# EAGLE design mainboard_eurobotics2010_r2 (EAGLE 4.16)

## Sheet 1 of 10
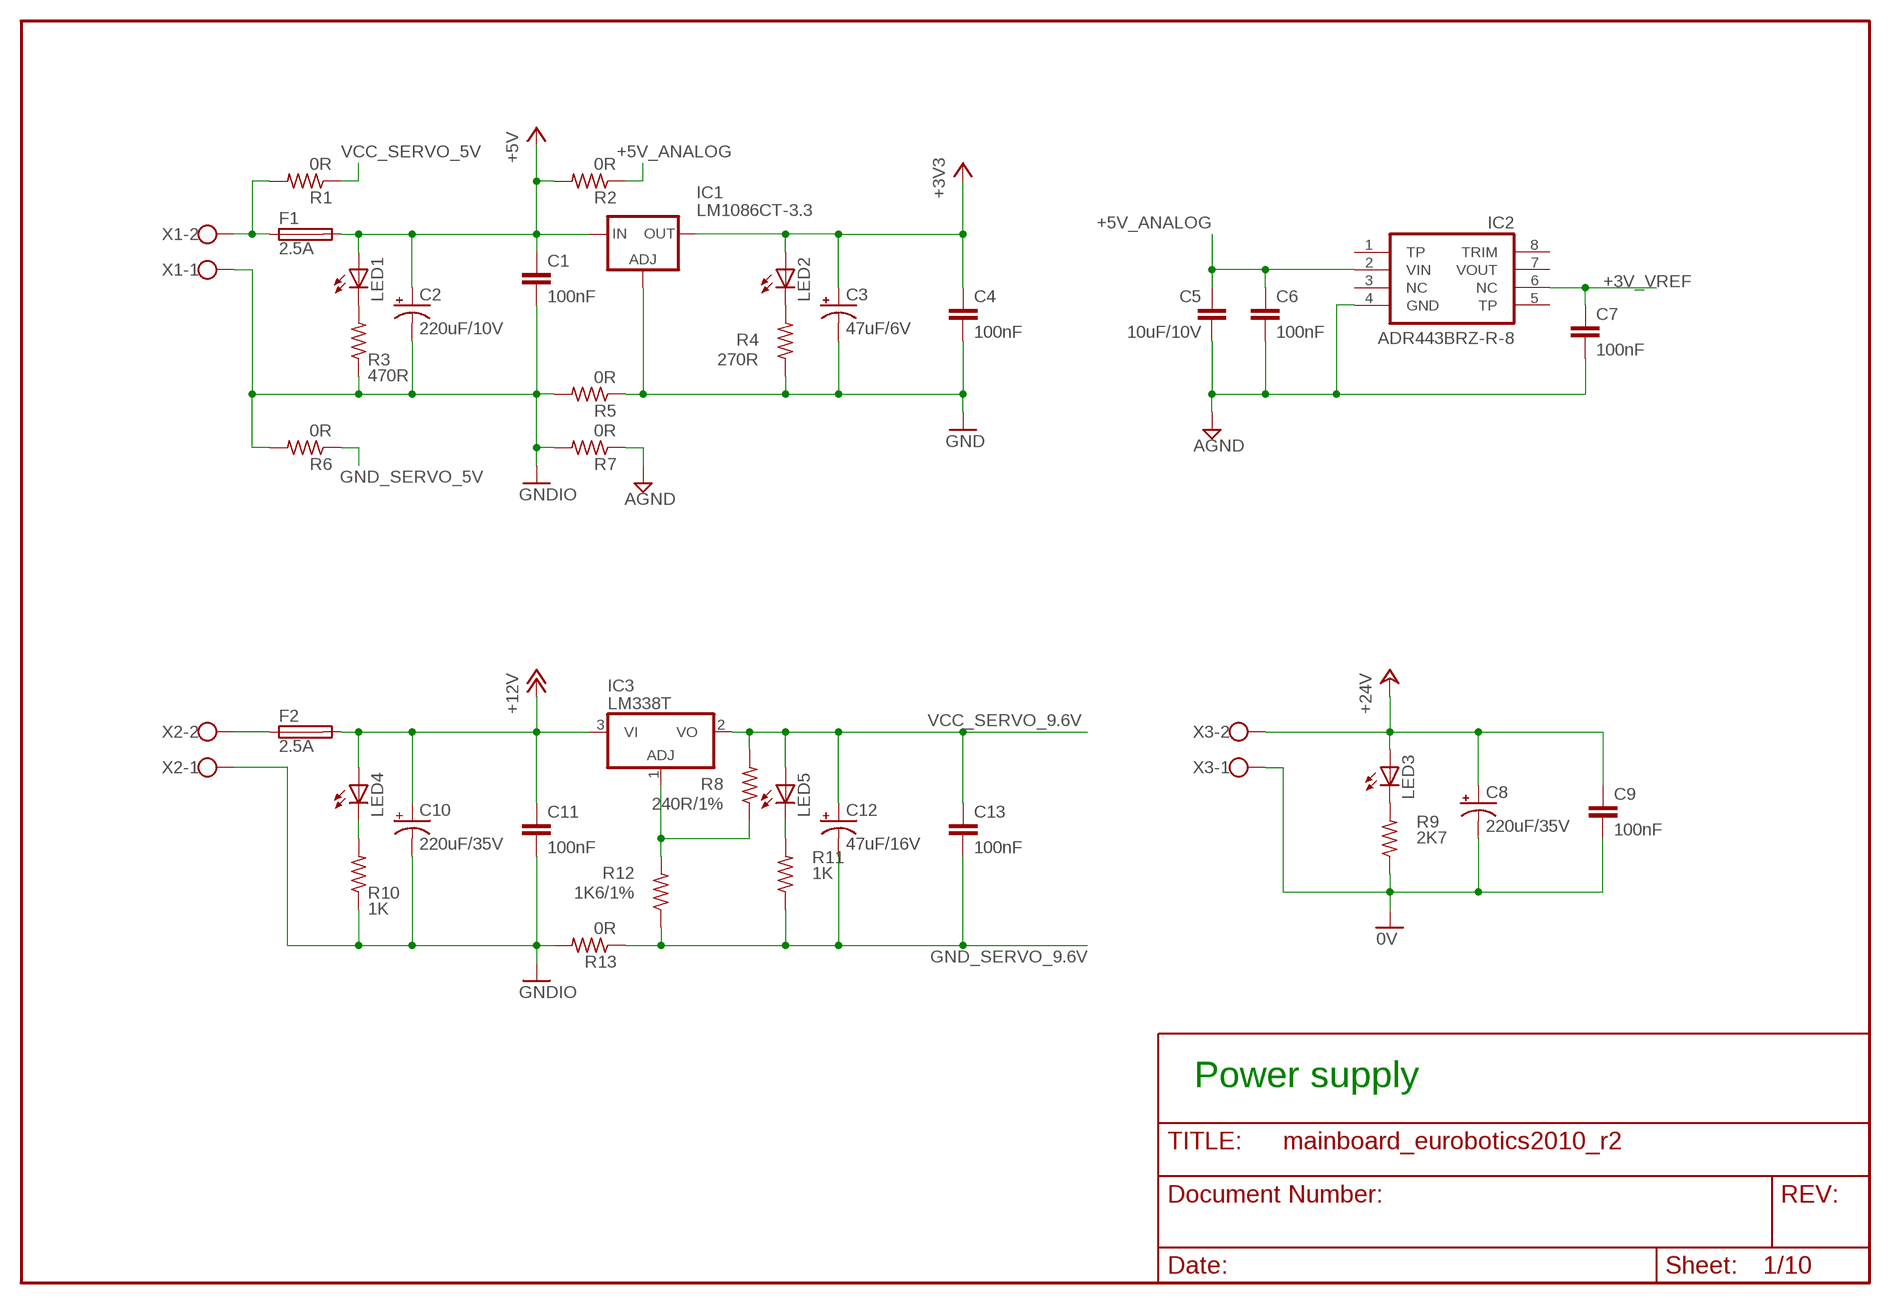
[diagram p0: schematic, sheet 1]

### Parts
C1  100nF  C-EUC0805  [C0805]
C2  220uF/10V  CPOL-USE2.5-7  [E2,5-7]
C3  47uF/6V  CPOL-USSMCD  [SMC_D]
C4  100nF  C-EUC0805  [C0805]
C5  10uF/10V  C-EUC1206  [C1206]
C6  100nF  C-EUC0805  [C0805]
C7  100nF  C-EUC0805  [C0805]
C8  220uF/35V  CPOL-USE5-10.5  [E5-10,5]
C9  100nF  C-EUC0805  [C0805]
C10  220uF/35V  CPOL-USE5-10.5  [E5-10,5]
C11  100nF  C-EUC0805  [C0805]
C12  47uF/16V  CPOL-USSMCD  [SMC_D]
C13  100nF  C-EUC0805  [C0805]
F1  2.5A  FUSEPICOFUSE  [PICOFUSE]
F2  2.5A  FUSEPICOFUSE  [PICOFUSE]
IC1  LM1086CT-3.3  LM317MABT  [TO220L1]
IC2  ADR443BRZ-R-8  ADR443  [SOIC8]
IC3  LM338T  317T  [TO220H]
LED1  LEDCHIP-LED0805  [CHIP-LED0805]
LED2  LEDCHIP-LED0805  [CHIP-LED0805]
LED3  LEDCHIP-LED0805  [CHIP-LED0805]
LED4  LEDCHIP-LED0805  [CHIP-LED0805]
LED5  LEDCHIP-LED0805  [CHIP-LED0805]
R1  0R  R-US_R0805  [R0805]
R2  0R  R-US_R0805  [R0805]
R3  470R  R-US_R0805  [R0805]
R4  270R  R-US_R0805  [R0805]
R5  0R  R-US_R0805  [R0805]
R6  0R  R-US_R0805  [R0805]
R7  0R  R-US_R0805  [R0805]
R8  240R/1%  R-US_R0805  [R0805]
R9  2K7  R-US_R0805  [R0805]
R10  1K  R-US_R0805  [R0805]
R11  1K  R-US_R0805  [R0805]
R12  1K6/1%  R-US_R0805  [R0805]
R13  0R  R-US_R0805  [R0805]
X1  W237-02P  [W237-132]
X2  W237-02P  [W237-132]
X3  W237-02P  [W237-132]

### Nets
0V: C8.- C9.2 R9.1 X3.1 ; also sheet 7,8
+3V3: C3.+ C4.1 IC1.2(OUT) LED2.A ; also sheet 2,3,9
+3V_VREF: C7.1 IC2.6(NC) ; also sheet 2,3,4,8
+5V: C1.1 C2.+ F1.2 IC1.3(IN) LED1.A R2.2 ; also sheet 2,5,6,7,8
+5V_ANALOG: C5.1 C6.1 IC2.2(VIN) R2.1 ; also sheet 4,8
+12V: C10.+ C11.1 F2.2 IC3.3(VI) LED4.A ; also sheet 4,5
+24V: C8.+ C9.1 LED3.A X3.2 ; also sheet 7,8
AGND: C5.2 C6.2 C7.2 IC2.4(GND) R7.1 ; also sheet 2,3,4,8
GND: C3.- C4.2 IC1.1(ADJ) R4.1 R5.1 ; also sheet 2,3,5,7,8,9
GND_SERVO_5V: R6.1 ; also sheet 6
GND_SERVO_9.6V: C12.- C13.2 R11.1 R12.1 R13.1 ; also sheet 6
GNDIO: C1.2 C2.- C10.- C11.2 R3.1 R5.2 R6.2 R7.2 R10.1 R13.2 X1.1 X2.1 ; also sheet 4,5
N$3: IC3.1(ADJ) R8.1 R12.2
N$12: LED5.C R11.2
N$64: LED1.C R3.2
N$65: LED2.C R4.2
N$66: LED4.C R10.2
N$67: LED3.C R9.2
N$112: F1.1 R1.2 X1.2
N$113: F2.1 X2.2
VCC_SERVO_5V: R1.1 ; also sheet 6
VCC_SERVO_9.6V: C12.+ C13.1 IC3.2(VO) LED5.A R8.2 ; also sheet 6
Unconnected: IC2.1(TP) IC2.3(NC) IC2.5(TP) IC2.7(VOUT) IC2.8(TRIM)

### Notes on the sheet
- Power supply

## Sheet 2 of 10
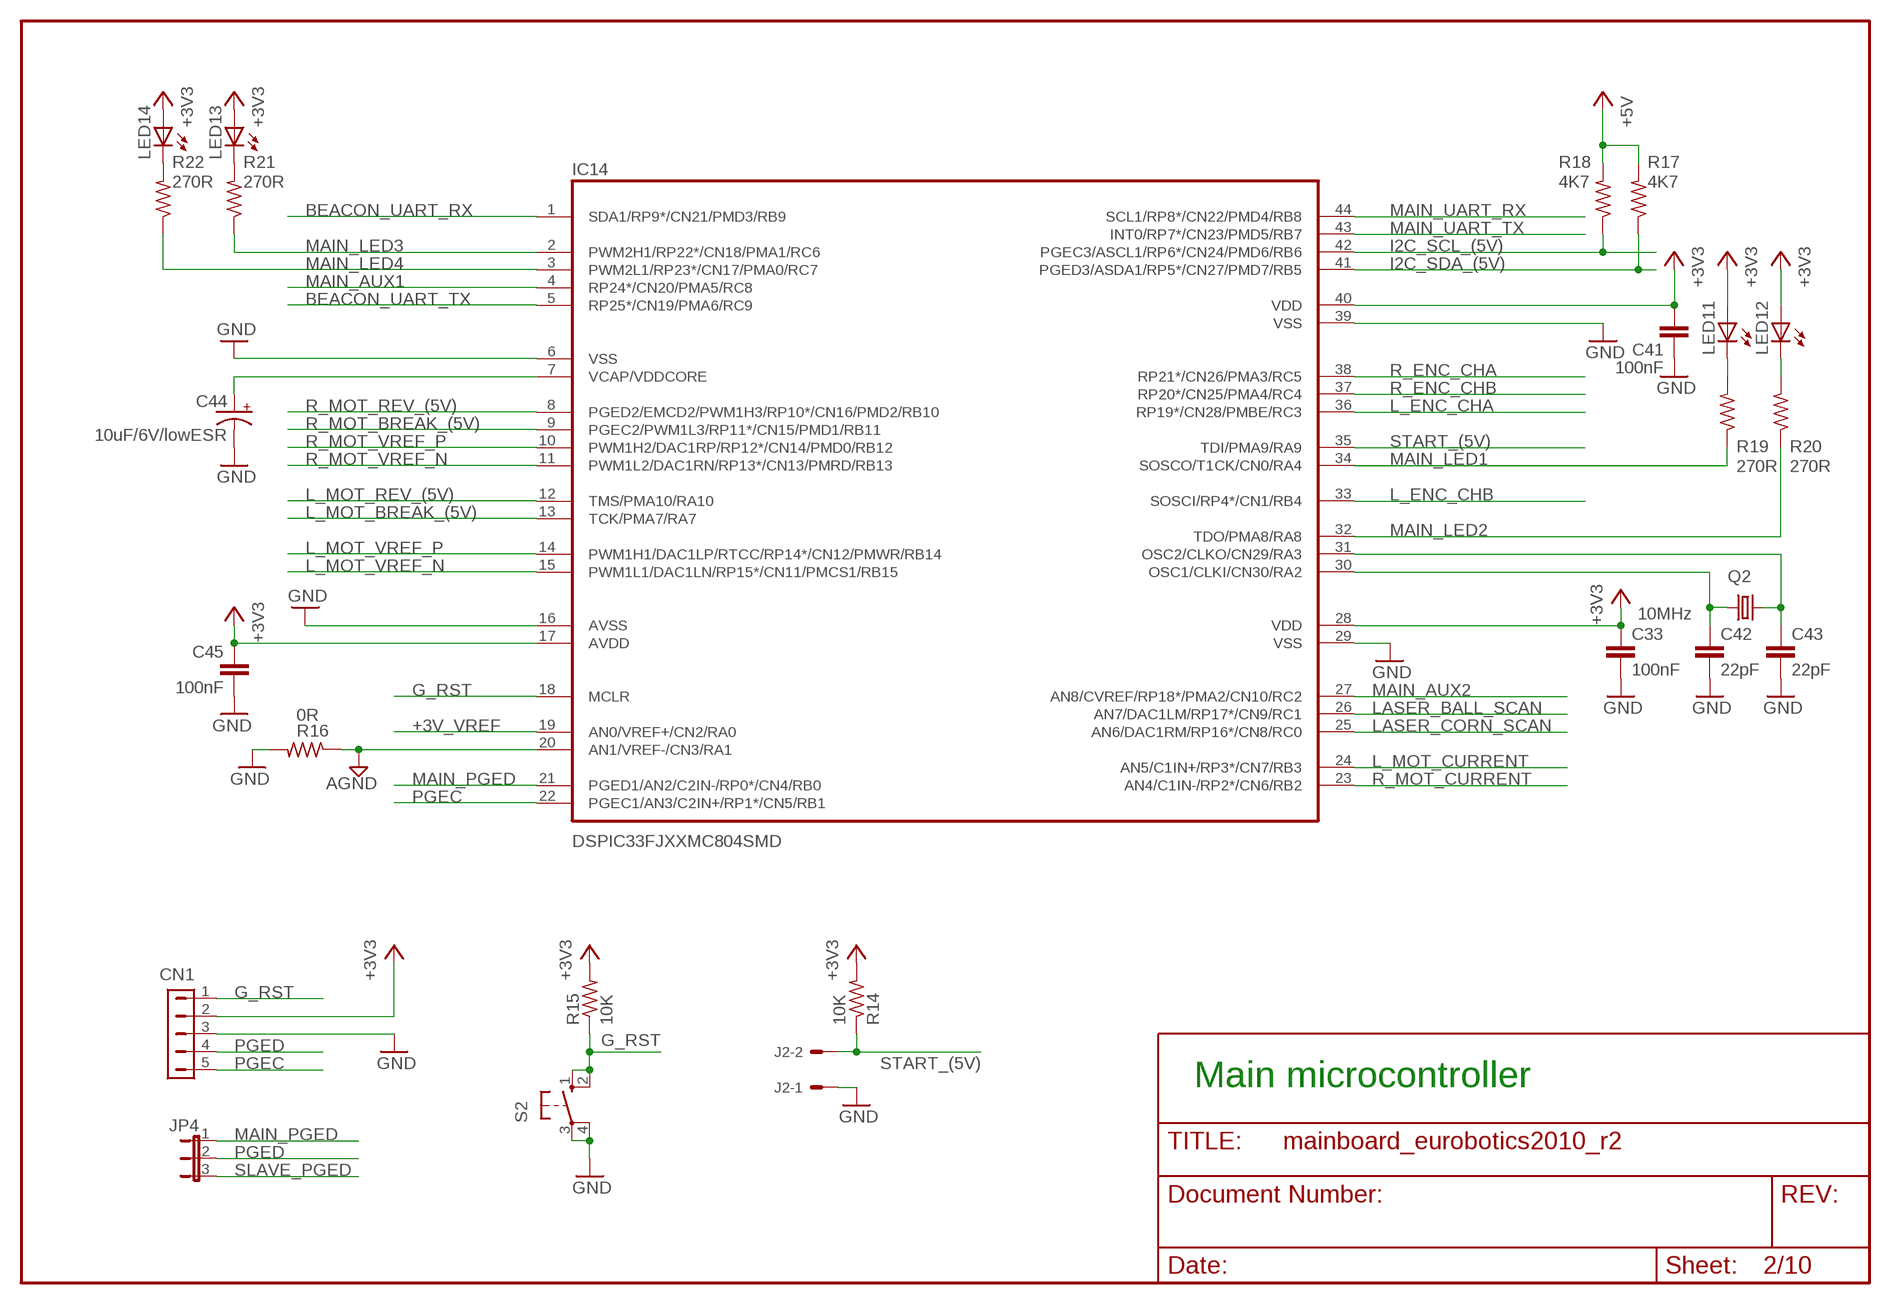
[diagram p1: schematic, sheet 2]

### Parts
C33  100nF  C-EUC0805  [C0805]
C41  100nF  C-EUC0805  [C0805]
C42  22pF  C-EUC0805  [C0805]
C43  22pF  C-EUC0805  [C0805]
C44  10uF/6V/lowESR  CPOL-USSMCA  [SMC_A]
C45  100nF  C-EUC0805  [C0805]
CN1  HDR-1X5-SIP-100  [SIP-100-5V]
IC14  DSPIC33FJXXMC804SMD  [TQFP44]
J2  22-27-2021-02  [6410-02]
JP4  JP2E  [JP2]
LED11  LEDCHIP-LED0805  [CHIP-LED0805]
LED12  LEDCHIP-LED0805  [CHIP-LED0805]
LED13  LEDCHIP-LED0805  [CHIP-LED0805]
LED14  LEDCHIP-LED0805  [CHIP-LED0805]
Q2  10MHz  CRYSTALHC49UP  [HC49UP]
R14  10K  R-US_R0805  [R0805]
R15  10K  R-US_R0805  [R0805]
R16  0R  R-US_R0805  [R0805]
R17  4K7  R-US_R0805  [R0805]
R18  4K7  R-US_R0805  [R0805]
R19  270R  R-US_R0805  [R0805]
R20  270R  R-US_R0805  [R0805]
R21  270R  R-US_R0805  [R0805]
R22  270R  R-US_R0805  [R0805]
S2  10-XX  [B3F-10XX]

### Nets
+3V3: C33.1 C41.1 C45.1 CN1.2 IC14.17(AVDD) IC14.28(VDD) IC14.40(VDD) LED11.A LED12.A LED13.A LED14.A R14.2 R15.2 ; also sheet 1,3,9
+3V_VREF: IC14.19(AN0/VREF+/CN2/RA0) ; also sheet 1,3,4,8
+5V: R17.2 R18.2 ; also sheet 1,5,6,7,8
AGND: IC14.20(AN1/VREF-/CN3/RA1) R16.1 ; also sheet 1,3,4,8
BEACON_UART_RX: IC14.1(SDA1/RP9*/CN21/PMD3/RB9) ; also sheet 9
BEACON_UART_TX: IC14.5(RP25*/CN19/PMA6/RC9) ; also sheet 9
G_RST: CN1.1 IC14.18(MCLR) R15.1 S2.1(S) S2.2(S1) ; also sheet 3
GND: C33.2 C41.2 C42.2 C43.2 C44.- C45.2 CN1.3 IC14.6(VSS) IC14.16(AVSS) IC14.29(VSS) IC14.39(VSS) J2.1 R16.2 S2.3(P) S2.4(P1) ; also sheet 1,3,5,7,8,9
I2C_SCL_(5V): IC14.42(PGEC3/ASCL1/RP6*/CN24/PMD6/RB6) R18.1 ; also sheet 3,5
I2C_SDA_(5V): IC14.41(PGED3/ASDA1/RP5*/CN27/PMD7/RB5) R17.1 ; also sheet 3,5
L_ENC_CHA: IC14.36(RP19*/CN28/PMBE/RC3) ; also sheet 5
L_ENC_CHB: IC14.33(SOSCI/RP4*/CN1/RB4) ; also sheet 5
L_MOT_BREAK_(5V): IC14.13(TCK/PMA7/RA7) ; also sheet 8
L_MOT_CURRENT: IC14.24(AN5/C1IN+/RP3*/CN7/RB3) ; also sheet 8
L_MOT_REV_(5V): IC14.12(TMS/PMA10/RA10) ; also sheet 8
L_MOT_VREF_N: IC14.15(PWM1L1/DAC1LN/RP15*/CN11/PMCS1/RB15) ; also sheet 8
L_MOT_VREF_P: IC14.14(PWM1H1/DAC1LP/RTCC/RP14*/CN12/PMWR/RB14) ; also sheet 8
LASER_BALL_SCAN: IC14.26(AN7/DAC1LM/RP17*/CN9/RC1) ; also sheet 4
LASER_CORN_SCAN: IC14.25(AN6/DAC1RM/RP16*/CN8/RC0) ; also sheet 4
MAIN_AUX1: IC14.4(RP24*/CN20/PMA5/RC8) ; also sheet 5
MAIN_AUX2: IC14.27(AN8/CVREF/RP18*/PMA2/CN10/RC2) ; also sheet 5
MAIN_LED1: IC14.34(SOSCO/T1CK/CN0/RA4) R19.1
MAIN_LED2: IC14.32(TDO/PMA8/RA8) R20.1
MAIN_LED3: IC14.2(PWM2H1/RP22*/CN18/PMA1/RC6) R21.1
MAIN_LED4: IC14.3(PWM2L1/RP23*/CN17/PMA0/RC7) R22.1
MAIN_PGED: IC14.21(PGED1/AN2/C2IN-/RP0*/CN4/RB0) JP4.1
MAIN_UART_RX: IC14.44(SCL1/RP8*/CN22/PMD4/RB8) ; also sheet 9
MAIN_UART_TX: IC14.43(INT0/RP7*/CN23/PMD5/RB7) ; also sheet 9
N$8: LED11.C R19.2
N$10: LED12.C R20.2
N$11: LED13.C R21.2
N$13: LED14.C R22.2
N$47: C43.1 IC14.31(OSC2/CLKO/CN29/RA3) Q2.2
N$48: C42.1 IC14.30(OSC1/CLKI/CN30/RA2) Q2.1
N$49: C44.+ IC14.7(VCAP/VDDCORE)
PGEC: CN1.5 IC14.22(PGEC1/AN3/C2IN+/RP1*/CN5/RB1) ; also sheet 3
PGED: CN1.4 JP4.2
R_ENC_CHA: IC14.38(RP21*/CN26/PMA3/RC5) ; also sheet 5
R_ENC_CHB: IC14.37(RP20*/CN25/PMA4/RC4) ; also sheet 5
R_MOT_BREAK_(5V): IC14.9(PGEC2/PWM1L3/RP11*/CN15/PMD1/RB11) ; also sheet 8
R_MOT_CURRENT: IC14.23(AN4/C1IN-/RP2*/CN6/RB2) ; also sheet 8
R_MOT_REV_(5V): IC14.8(PGED2/EMCD2/PWM1H3/RP10*/CN16/PMD2/RB10) ; also sheet 8
R_MOT_VREF_N: IC14.11(PWM1L2/DAC1RN/RP13*/CN13/PMRD/RB13) ; also sheet 8
R_MOT_VREF_P: IC14.10(PWM1H2/DAC1RP/RP12*/CN14/PMD0/RB12) ; also sheet 8
SLAVE_PGED: JP4.3 ; also sheet 3
START_(5V): IC14.35(TDI/PMA9/RA9) J2.2 R14.1

### Notes on the sheet
- Main microcontroller

## Sheet 3 of 10
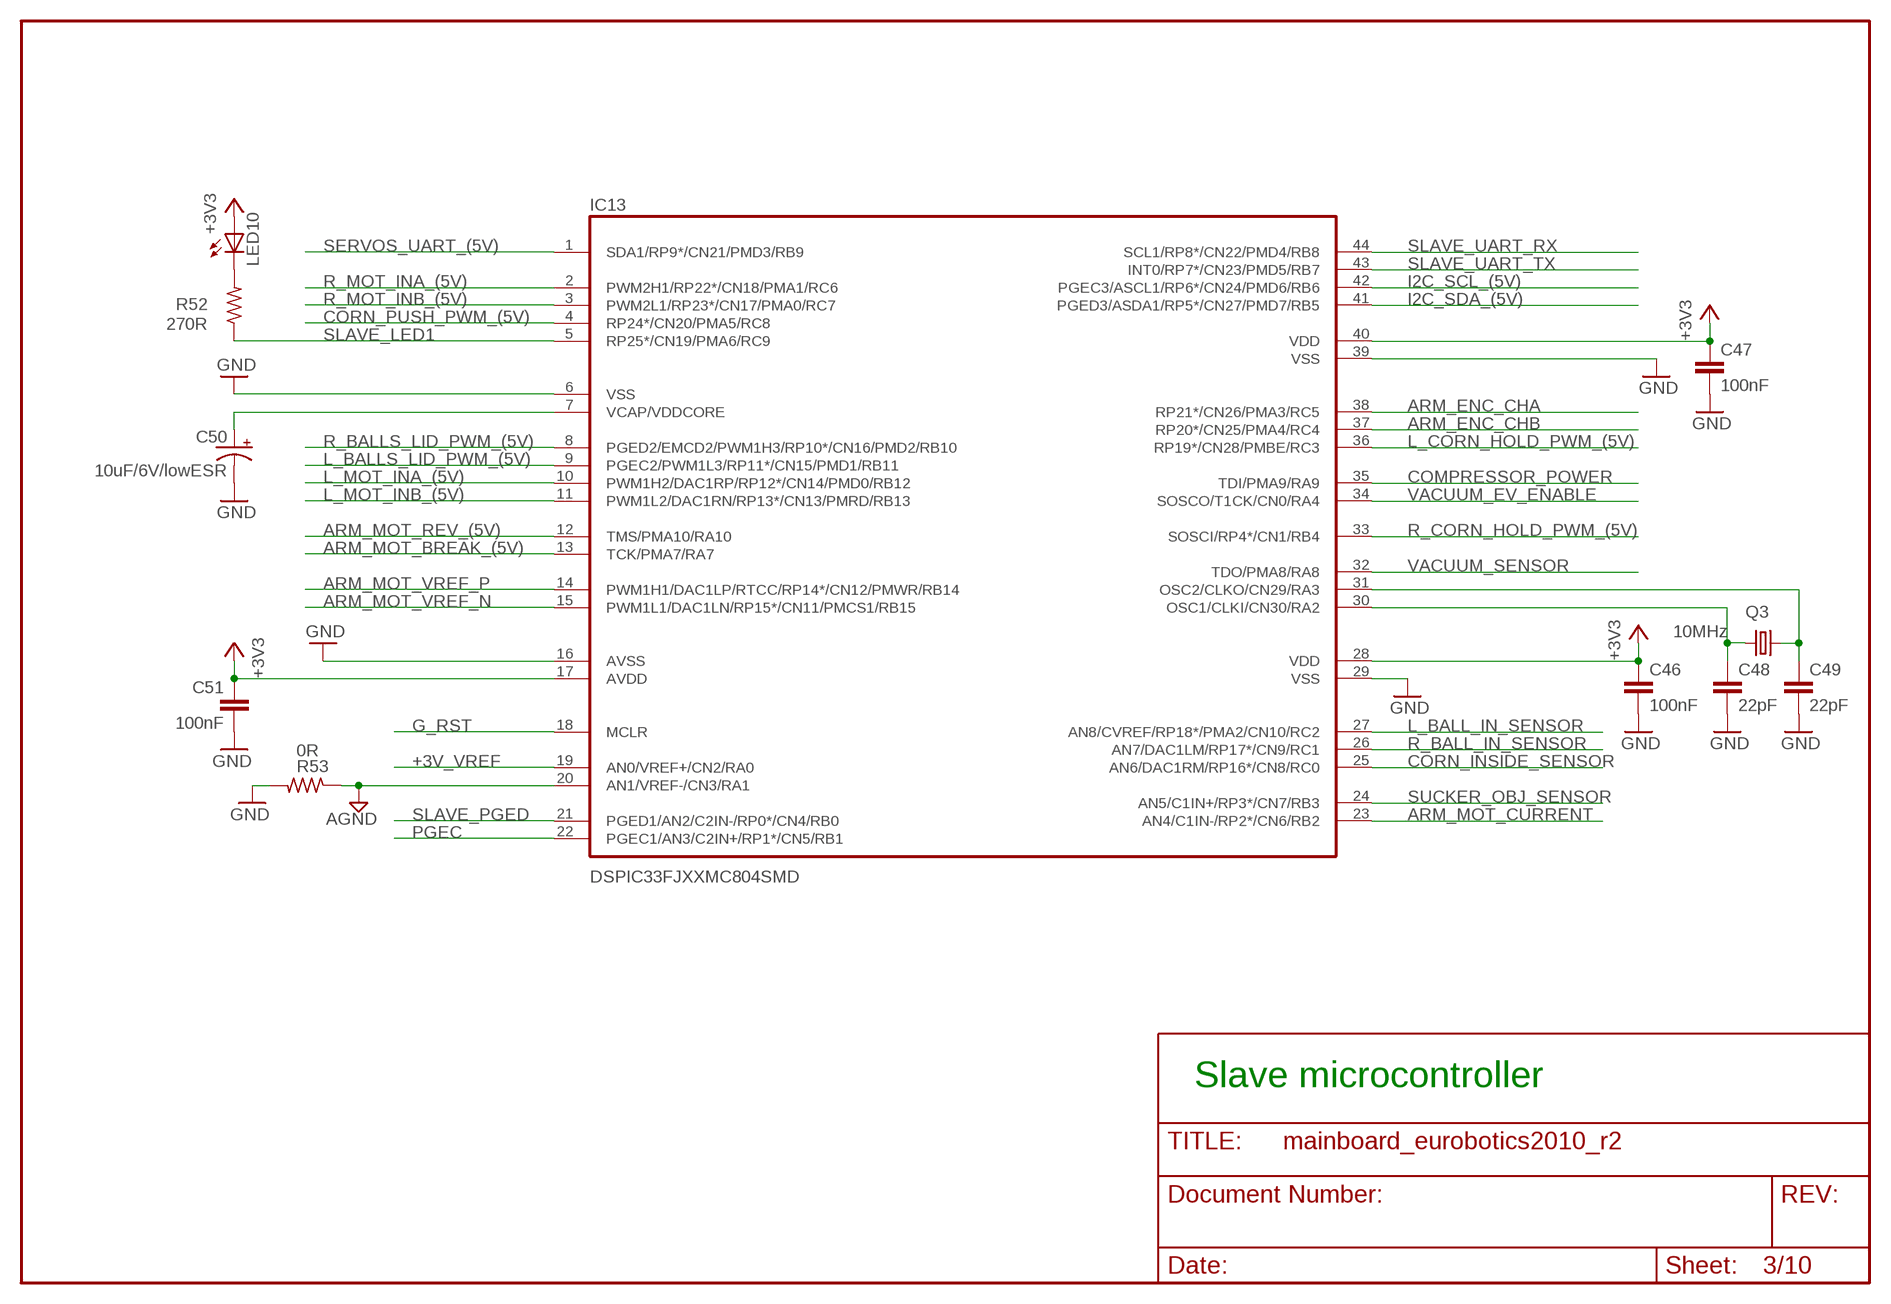
[diagram p2: schematic, sheet 3]

### Parts
C46  100nF  C-EUC0805  [C0805]
C47  100nF  C-EUC0805  [C0805]
C48  22pF  C-EUC0805  [C0805]
C49  22pF  C-EUC0805  [C0805]
C50  10uF/6V/lowESR  CPOL-USSMCA  [SMC_A]
C51  100nF  C-EUC0805  [C0805]
IC13  DSPIC33FJXXMC804SMD  [TQFP44]
LED10  LEDCHIP-LED0805  [CHIP-LED0805]
Q3  10MHz  CRYSTALHC49UP  [HC49UP]
R52  270R  R-US_R0805  [R0805]
R53  0R  R-US_R0805  [R0805]

### Nets
+3V3: C46.1 C47.1 C51.1 IC13.17(AVDD) IC13.28(VDD) IC13.40(VDD) LED10.A ; also sheet 1,2,9
+3V_VREF: IC13.19(AN0/VREF+/CN2/RA0) ; also sheet 1,2,4,8
AGND: IC13.20(AN1/VREF-/CN3/RA1) R53.1 ; also sheet 1,2,4,8
ARM_ENC_CHA: IC13.38(RP21*/CN26/PMA3/RC5) ; also sheet 5
ARM_ENC_CHB: IC13.37(RP20*/CN25/PMA4/RC4) ; also sheet 5
ARM_MOT_BREAK_(5V): IC13.13(TCK/PMA7/RA7) ; also sheet 8
ARM_MOT_CURRENT: IC13.23(AN4/C1IN-/RP2*/CN6/RB2) ; also sheet 8
ARM_MOT_REV_(5V): IC13.12(TMS/PMA10/RA10) ; also sheet 8
ARM_MOT_VREF_N: IC13.15(PWM1L1/DAC1LN/RP15*/CN11/PMCS1/RB15) ; also sheet 8
ARM_MOT_VREF_P: IC13.14(PWM1H1/DAC1LP/RTCC/RP14*/CN12/PMWR/RB14) ; also sheet 8
COMPRESSOR_POWER: IC13.35(TDI/PMA9/RA9) ; also sheet 7
CORN_INSIDE_SENSOR: IC13.25(AN6/DAC1RM/RP16*/CN8/RC0) ; also sheet 5
CORN_PUSH_PWM_(5V): IC13.4(RP24*/CN20/PMA5/RC8) ; also sheet 6
G_RST: IC13.18(MCLR) ; also sheet 2
GND: C46.2 C47.2 C48.2 C49.2 C50.- C51.2 IC13.6(VSS) IC13.16(AVSS) IC13.29(VSS) IC13.39(VSS) R53.2 ; also sheet 1,2,5,7,8,9
I2C_SCL_(5V): IC13.42(PGEC3/ASCL1/RP6*/CN24/PMD6/RB6) ; also sheet 2,5
I2C_SDA_(5V): IC13.41(PGED3/ASDA1/RP5*/CN27/PMD7/RB5) ; also sheet 2,5
L_BALL_IN_SENSOR: IC13.27(AN8/CVREF/RP18*/PMA2/CN10/RC2) ; also sheet 5
L_BALLS_LID_PWM_(5V): IC13.9(PGEC2/PWM1L3/RP11*/CN15/PMD1/RB11) ; also sheet 6
L_CORN_HOLD_PWM_(5V): IC13.36(RP19*/CN28/PMBE/RC3) ; also sheet 6
L_MOT_INA_(5V): IC13.10(PWM1H2/DAC1RP/RP12*/CN14/PMD0/RB12) ; also sheet 7
L_MOT_INB_(5V): IC13.11(PWM1L2/DAC1RN/RP13*/CN13/PMRD/RB13) ; also sheet 7
N$1: LED10.C R52.2
N$50: C49.1 IC13.31(OSC2/CLKO/CN29/RA3) Q3.2
N$51: C48.1 IC13.30(OSC1/CLKI/CN30/RA2) Q3.1
N$52: C50.+ IC13.7(VCAP/VDDCORE)
PGEC: IC13.22(PGEC1/AN3/C2IN+/RP1*/CN5/RB1) ; also sheet 2
R_BALL_IN_SENSOR: IC13.26(AN7/DAC1LM/RP17*/CN9/RC1) ; also sheet 5
R_BALLS_LID_PWM_(5V): IC13.8(PGED2/EMCD2/PWM1H3/RP10*/CN16/PMD2/RB10) ; also sheet 6
R_CORN_HOLD_PWM_(5V): IC13.33(SOSCI/RP4*/CN1/RB4) ; also sheet 6
R_MOT_INA_(5V): IC13.2(PWM2H1/RP22*/CN18/PMA1/RC6) ; also sheet 7
R_MOT_INB_(5V): IC13.3(PWM2L1/RP23*/CN17/PMA0/RC7) ; also sheet 7
SERVOS_UART_(5V): IC13.1(SDA1/RP9*/CN21/PMD3/RB9) ; also sheet 6
SLAVE_LED1: IC13.5(RP25*/CN19/PMA6/RC9) R52.1
SLAVE_PGED: IC13.21(PGED1/AN2/C2IN-/RP0*/CN4/RB0) ; also sheet 2
SLAVE_UART_RX: IC13.44(SCL1/RP8*/CN22/PMD4/RB8) ; also sheet 9
SLAVE_UART_TX: IC13.43(INT0/RP7*/CN23/PMD5/RB7) ; also sheet 9
SUCKER_OBJ_SENSOR: IC13.24(AN5/C1IN+/RP3*/CN7/RB3) ; also sheet 5
VACUUM_EV_ENABLE: IC13.34(SOSCO/T1CK/CN0/RA4) ; also sheet 7
VACUUM_SENSOR: IC13.32(TDO/PMA8/RA8) ; also sheet 5

### Notes on the sheet
- Slave microcontroller

## Sheet 4 of 10
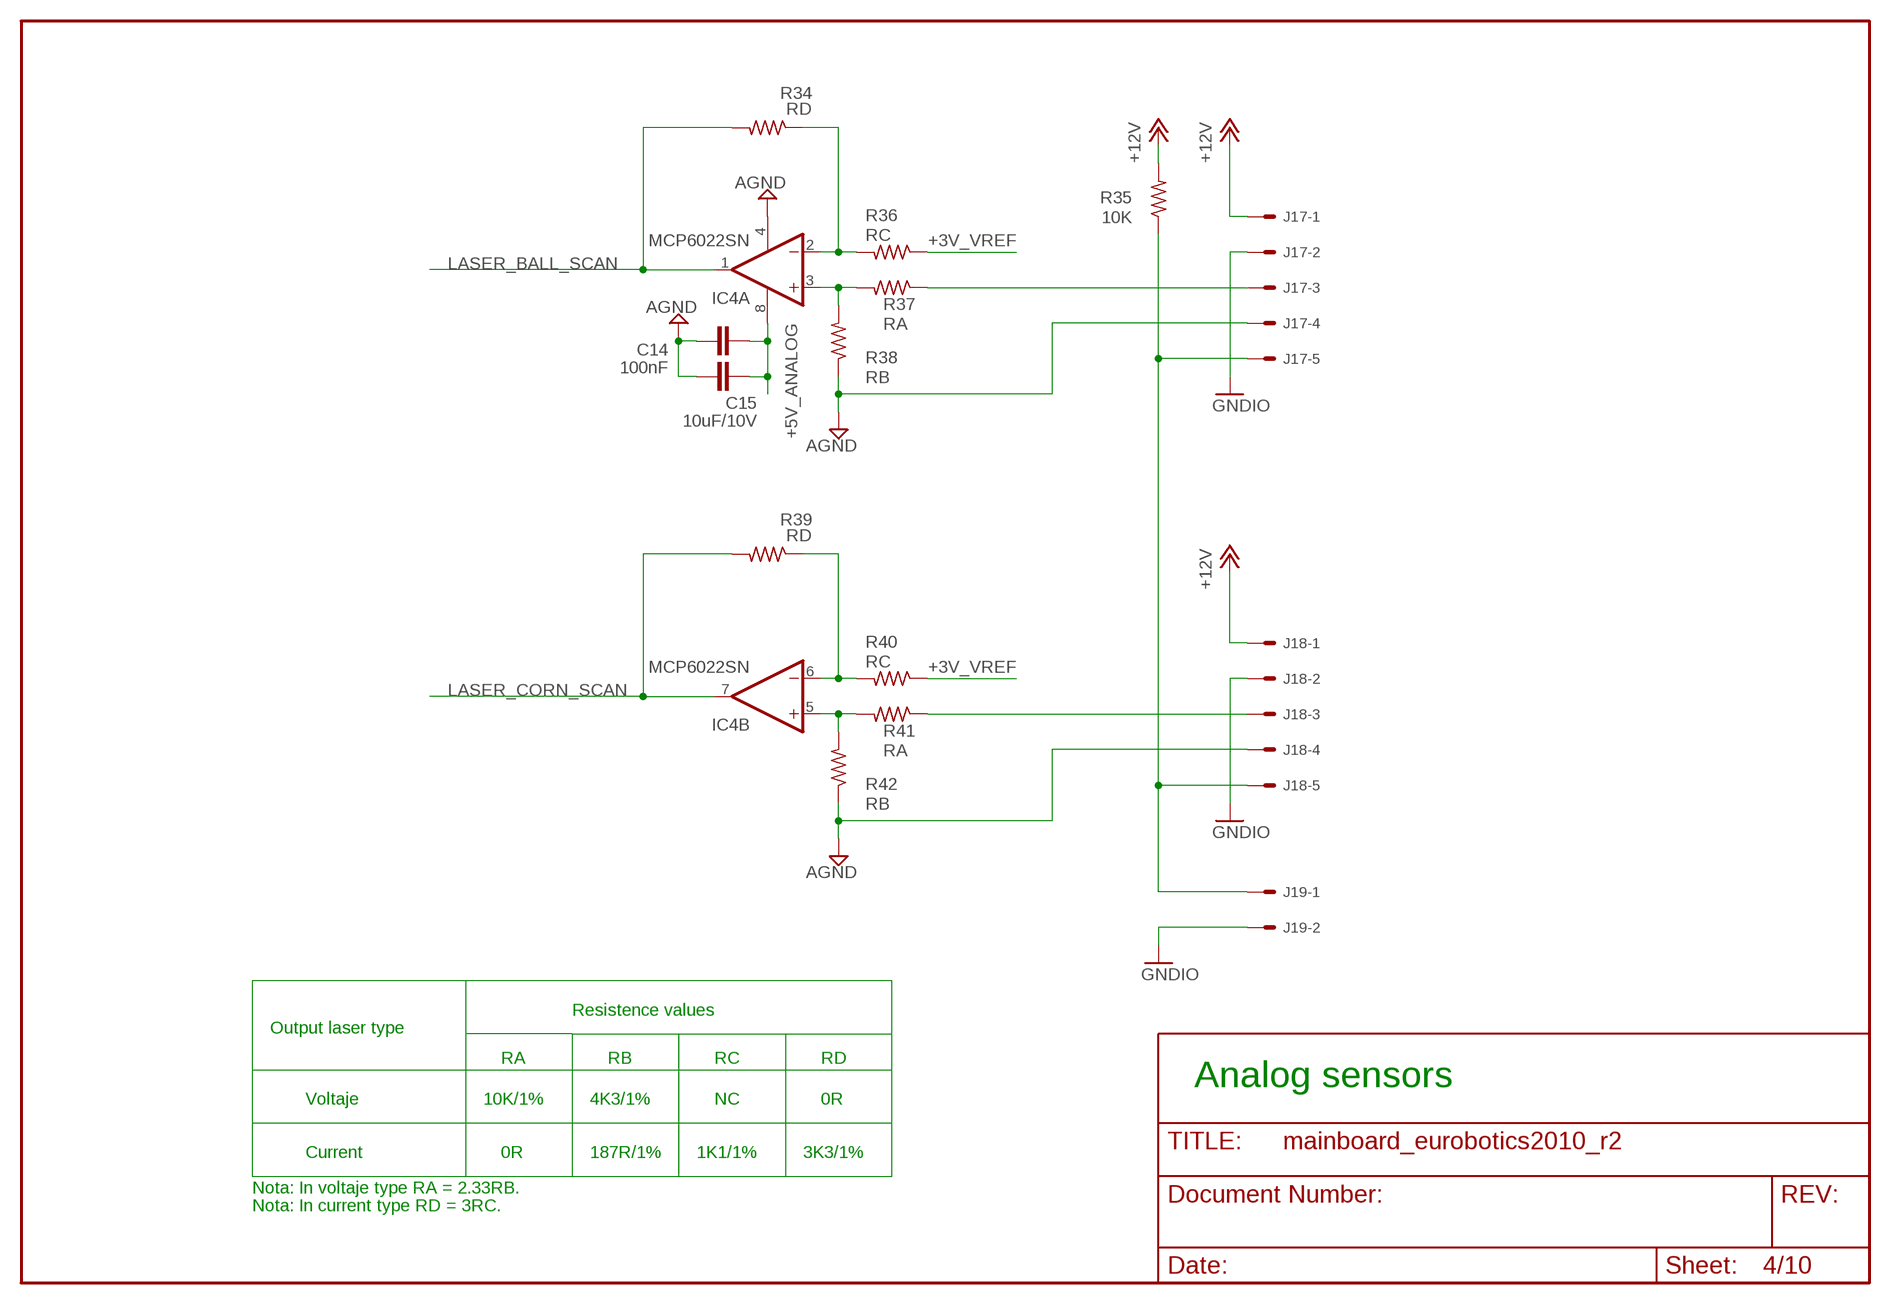
[diagram p3: schematic, sheet 4]

### Parts
C14  100nF  C-EUC0805  [C0805]
C15  10uF/10V  C-EUC1206  [C1206]
IC4  MCP6022SN  OPA2344U  [SO08]
J17  22-27-2051-05  [6410-05]
J18  22-27-2051-05  [6410-05]
J19  22-27-2021-02  [6410-02]
R34  RD  R-US_R0805  [R0805]
R35  10K  R-US_R0805  [R0805]
R36  RC  R-US_R0805  [R0805]
R37  RA  R-US_R0805  [R0805]
R38  RB  R-US_R0805  [R0805]
R39  RD  R-US_R0805  [R0805]
R40  RC  R-US_R0805  [R0805]
R41  RA  R-US_R0805  [R0805]
R42  RB  R-US_R0805  [R0805]

### Nets
+3V_VREF: R36.1 R40.1 ; also sheet 1,2,3,8
+5V_ANALOG: C14.1 C15.2 IC4.8(A:V+) ; also sheet 1,8
+12V: J17.1 J18.1 R35.2 ; also sheet 1,5
AGND: C14.2 C15.1 IC4.4(A:V-) J17.4 J18.4 R38.1 R42.1 ; also sheet 1,2,3,8
GNDIO: J17.2 J18.2 J19.2 ; also sheet 1,5
LASER_BALL_SCAN: IC4.1(A:OUT) R34.2 ; also sheet 2
LASER_CORN_SCAN: IC4.7(B:OUT) R39.2 ; also sheet 2
N$5: J17.3 R37.1
N$36: IC4.2(A:-IN) R34.1 R36.2
N$40: IC4.3(A:+IN) R37.2 R38.2
N$92: J17.5 J18.5 J19.1 R35.1
N$94: IC4.6(B:-IN) R39.1 R40.2
N$95: IC4.5(B:+IN) R41.2 R42.2
N$96: J18.3 R41.1

### Notes on the sheet
- Resistence values
- Output laser type
- RA | RB | RC | RD
- Analog sensors
- Voltaje | 10K/1% | 4K3/1% | NC | 0R
- Current | 0R | 187R/1% | 1K1/1% | 3K3/1%
- Nota: In voltaje type RA = 2.33RB.
- Nota: In current type RD = 3RC.

## Sheet 5 of 10
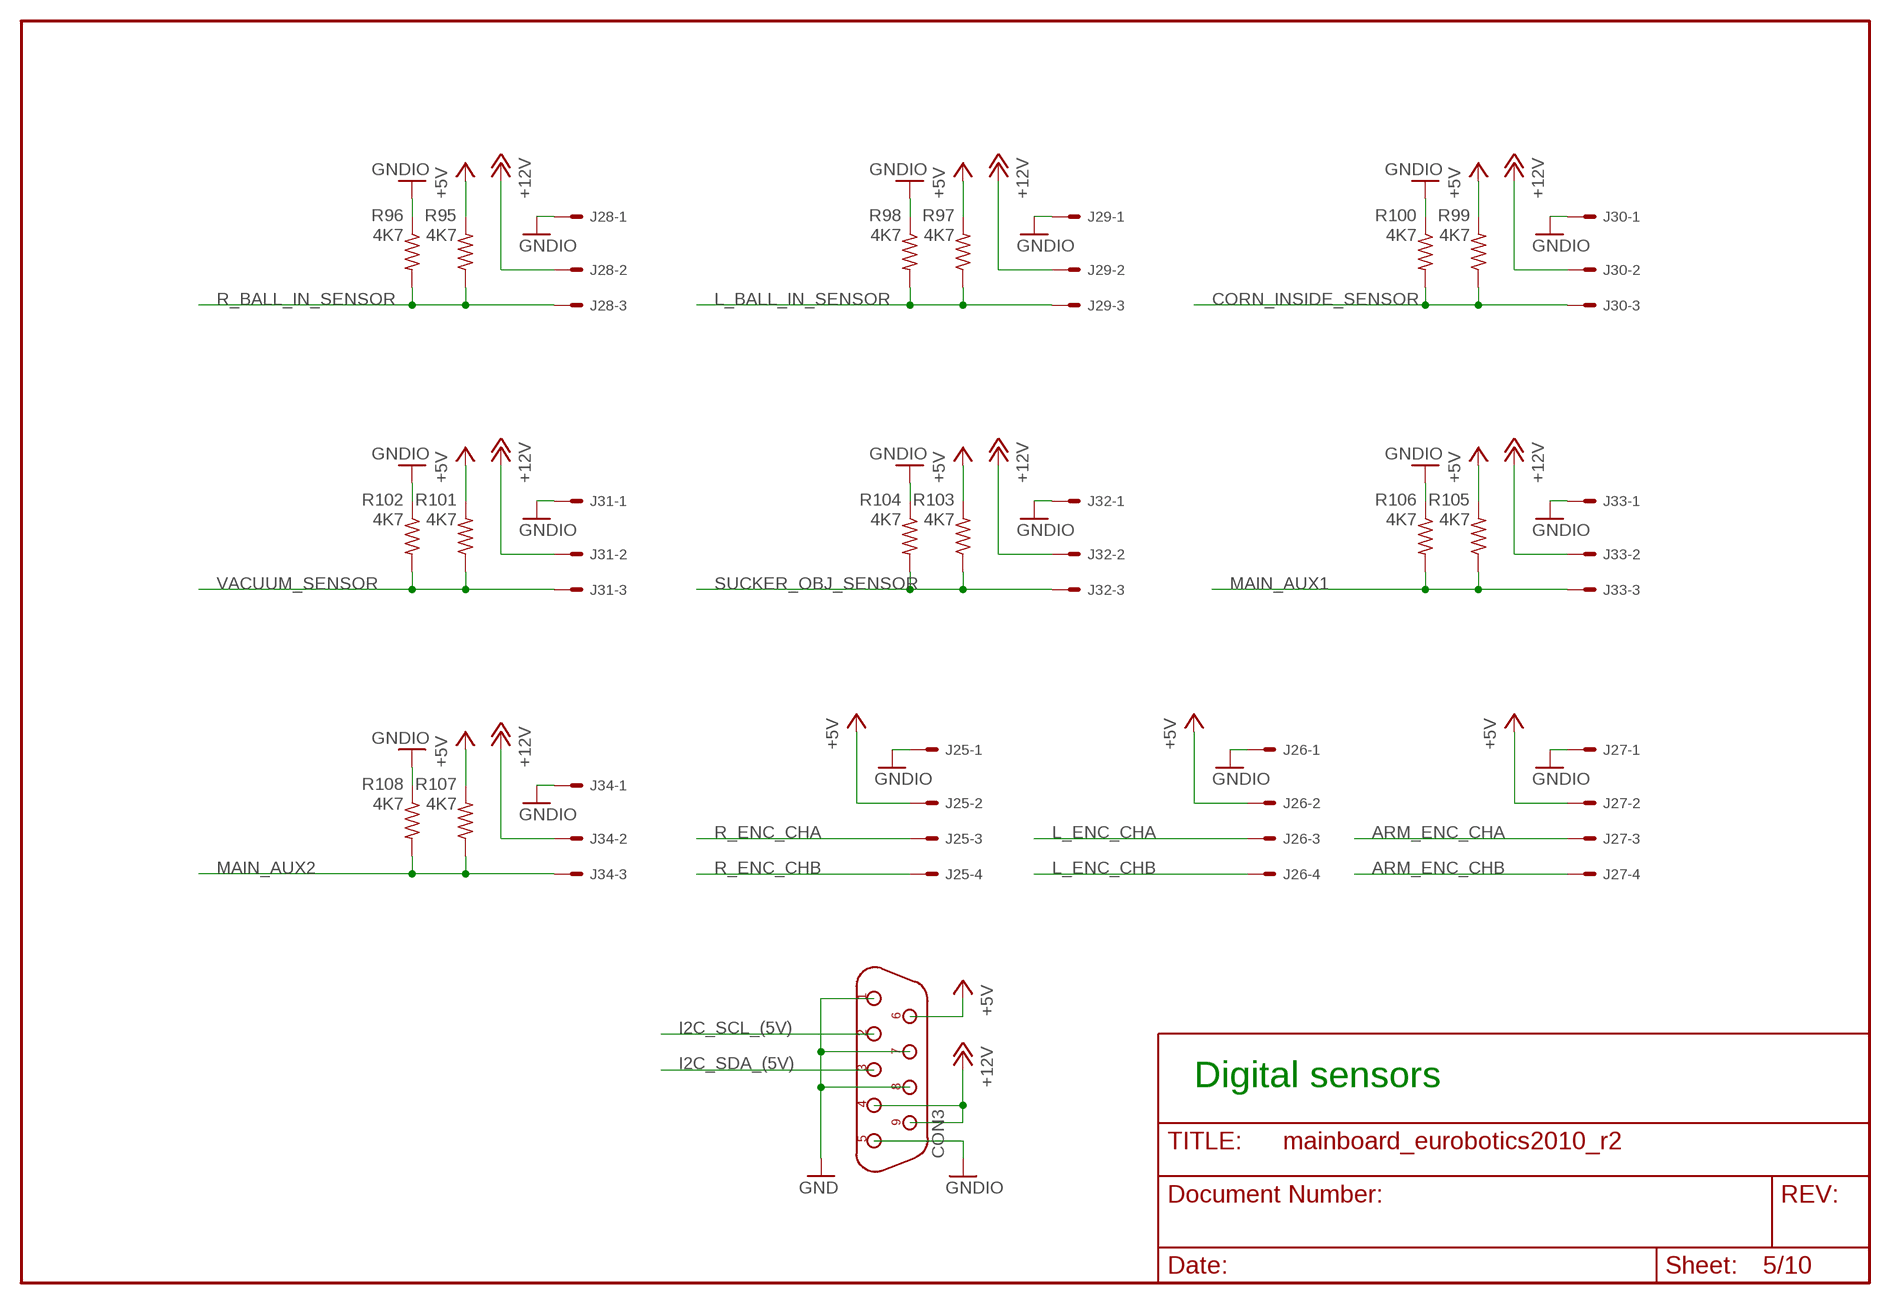
[diagram p4: schematic, sheet 5]

### Parts
CON3  DB9F  [D-09F]
J25  22-27-2041-04  [6410-04]
J26  22-27-2041-04  [6410-04]
J27  22-27-2041-04  [6410-04]
J28  22-27-2031-03  [6410-03]
J29  22-27-2031-03  [6410-03]
J30  22-27-2031-03  [6410-03]
J31  22-27-2031-03  [6410-03]
J32  22-27-2031-03  [6410-03]
J33  22-27-2031-03  [6410-03]
J34  22-27-2031-03  [6410-03]
R95  4K7  R-US_R0805  [R0805]
R96  4K7  R-US_R0805  [R0805]
R97  4K7  R-US_R0805  [R0805]
R98  4K7  R-US_R0805  [R0805]
R99  4K7  R-US_R0805  [R0805]
R100  4K7  R-US_R0805  [R0805]
R101  4K7  R-US_R0805  [R0805]
R102  4K7  R-US_R0805  [R0805]
R103  4K7  R-US_R0805  [R0805]
R104  4K7  R-US_R0805  [R0805]
R105  4K7  R-US_R0805  [R0805]
R106  4K7  R-US_R0805  [R0805]
R107  4K7  R-US_R0805  [R0805]
R108  4K7  R-US_R0805  [R0805]

### Nets
+5V: CON3.6 J25.2 J26.2 J27.2 R95.2 R97.2 R99.2 R101.2 R103.2 R105.2 R107.2 ; also sheet 1,2,6,7,8
+12V: CON3.4 CON3.9 J28.2 J29.2 J30.2 J31.2 J32.2 J33.2 J34.2 ; also sheet 1,4
ARM_ENC_CHA: J27.3 ; also sheet 3
ARM_ENC_CHB: J27.4 ; also sheet 3
CORN_INSIDE_SENSOR: J30.3 R99.1 R100.2 ; also sheet 3
GND: CON3.1 CON3.7 CON3.8 ; also sheet 1,2,3,7,8,9
GNDIO: CON3.5 J25.1 J26.1 J27.1 J28.1 J29.1 J30.1 J31.1 J32.1 J33.1 J34.1 R96.1 R98.1 R100.1 R102.1 R104.1 R106.1 R108.1 ; also sheet 1,4
I2C_SCL_(5V): CON3.2 ; also sheet 2,3
I2C_SDA_(5V): CON3.3 ; also sheet 2,3
L_BALL_IN_SENSOR: J29.3 R97.1 R98.2 ; also sheet 3
L_ENC_CHA: J26.3 ; also sheet 2
L_ENC_CHB: J26.4 ; also sheet 2
MAIN_AUX1: J33.3 R105.1 R106.2 ; also sheet 2
MAIN_AUX2: J34.3 R107.1 R108.2 ; also sheet 2
R_BALL_IN_SENSOR: J28.3 R95.1 R96.2 ; also sheet 3
R_ENC_CHA: J25.3 ; also sheet 2
R_ENC_CHB: J25.4 ; also sheet 2
SUCKER_OBJ_SENSOR: J32.3 R103.1 R104.2 ; also sheet 3
VACUUM_SENSOR: J31.3 R101.1 R102.2 ; also sheet 3

### Notes on the sheet
- Digital sensors

## Sheet 6 of 10
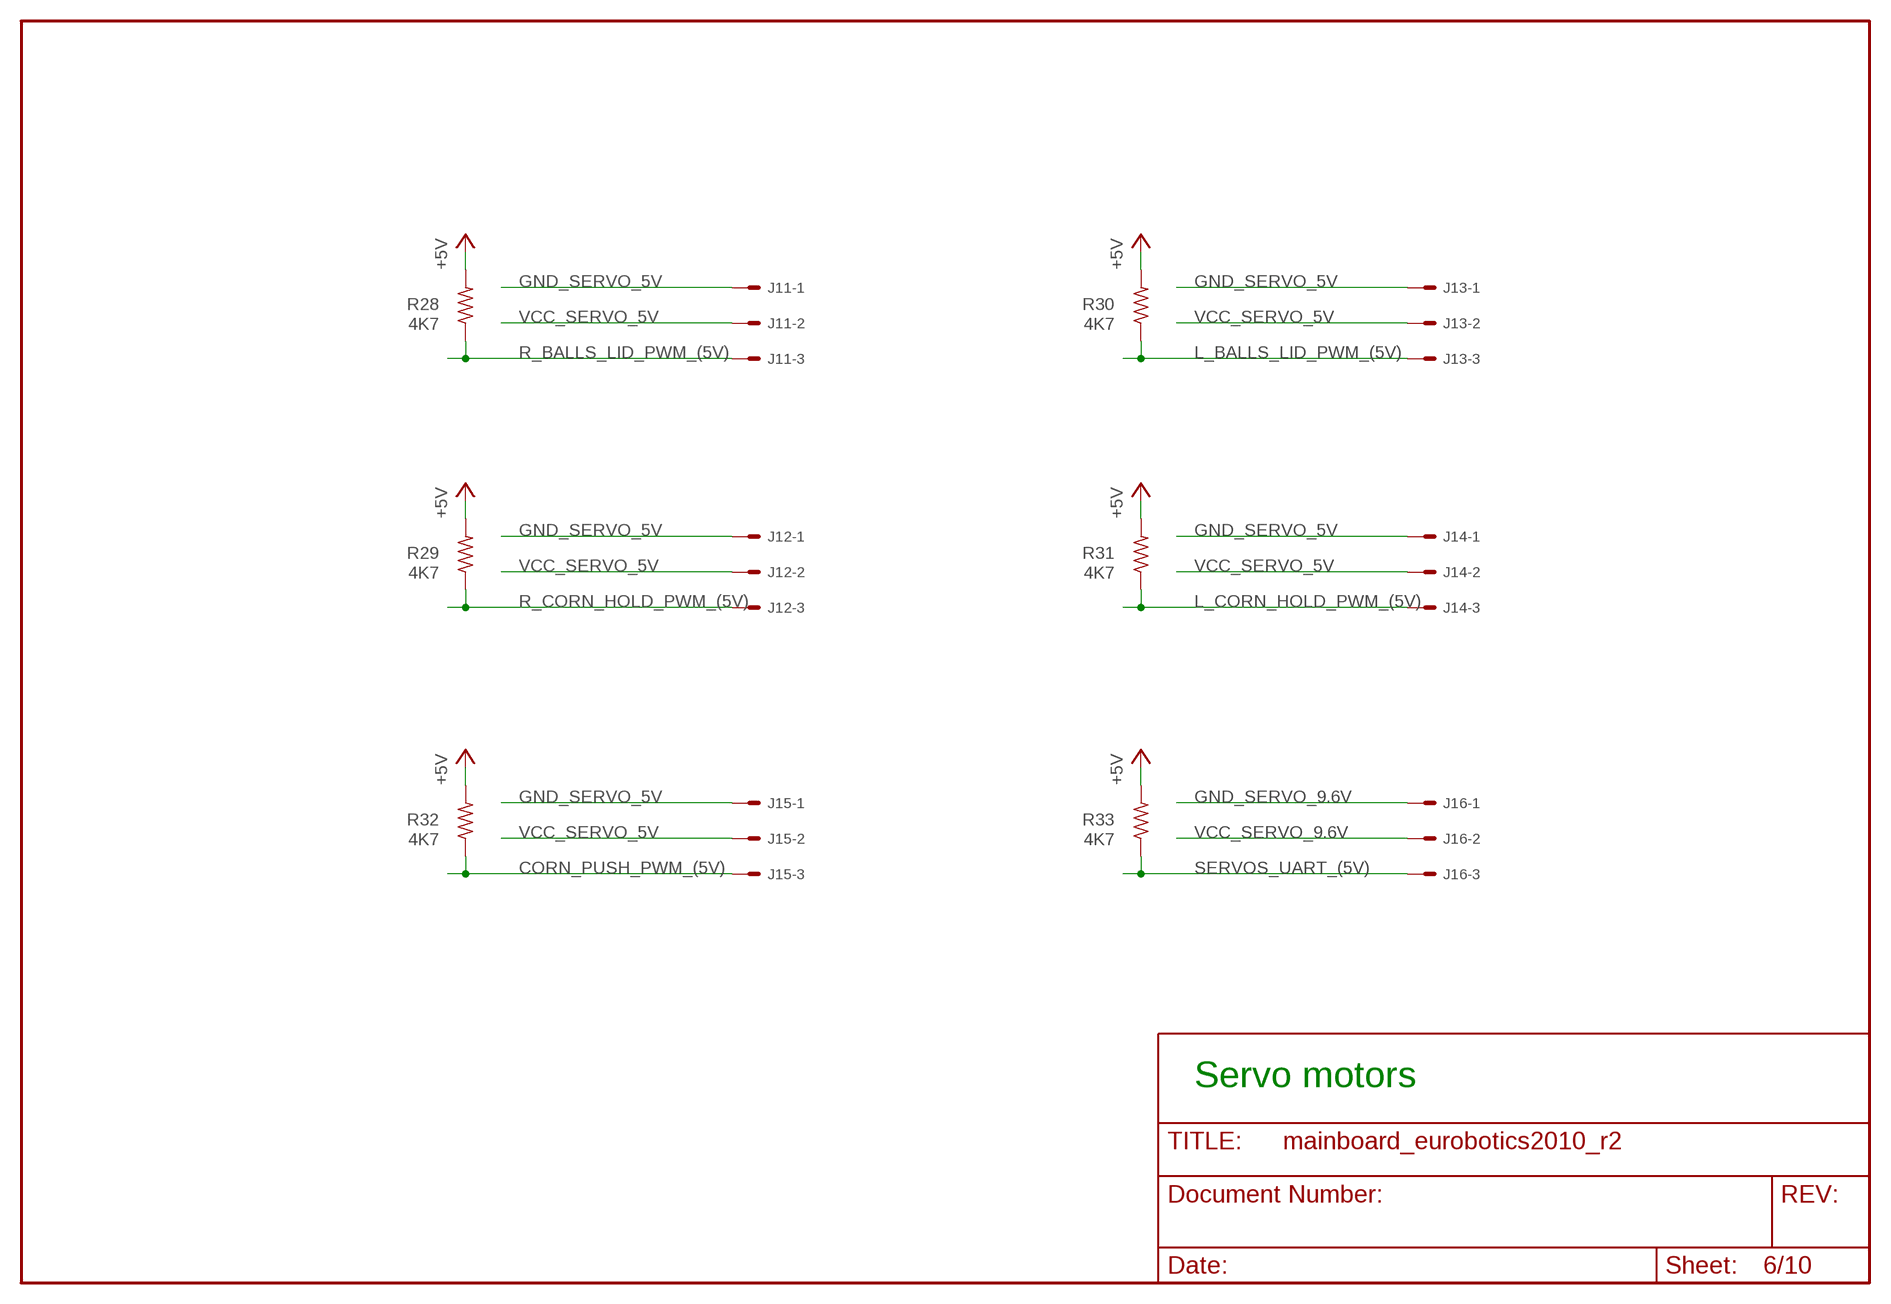
[diagram p5: schematic, sheet 6]

### Parts
J11  22-27-2031-03  [6410-03]
J12  22-27-2031-03  [6410-03]
J13  22-27-2031-03  [6410-03]
J14  22-27-2031-03  [6410-03]
J15  22-27-2031-03  [6410-03]
J16  22-27-2031-03  [6410-03]
R28  4K7  R-US_R0805  [R0805]
R29  4K7  R-US_R0805  [R0805]
R30  4K7  R-US_R0805  [R0805]
R31  4K7  R-US_R0805  [R0805]
R32  4K7  R-US_R0805  [R0805]
R33  4K7  R-US_R0805  [R0805]

### Nets
+5V: R28.2 R29.2 R30.2 R31.2 R32.2 R33.2 ; also sheet 1,2,5,7,8
CORN_PUSH_PWM_(5V): J15.3 R32.1 ; also sheet 3
GND_SERVO_5V: J11.1 J12.1 J13.1 J14.1 J15.1 ; also sheet 1
GND_SERVO_9.6V: J16.1 ; also sheet 1
L_BALLS_LID_PWM_(5V): J13.3 R30.1 ; also sheet 3
L_CORN_HOLD_PWM_(5V): J14.3 R31.1 ; also sheet 3
R_BALLS_LID_PWM_(5V): J11.3 R28.1 ; also sheet 3
R_CORN_HOLD_PWM_(5V): J12.3 R29.1 ; also sheet 3
SERVOS_UART_(5V): J16.3 R33.1 ; also sheet 3
VCC_SERVO_5V: J11.2 J12.2 J13.2 J14.2 J15.2 ; also sheet 1
VCC_SERVO_9.6V: J16.2 ; also sheet 1

### Notes on the sheet
- Servo motors

## Sheet 7 of 10
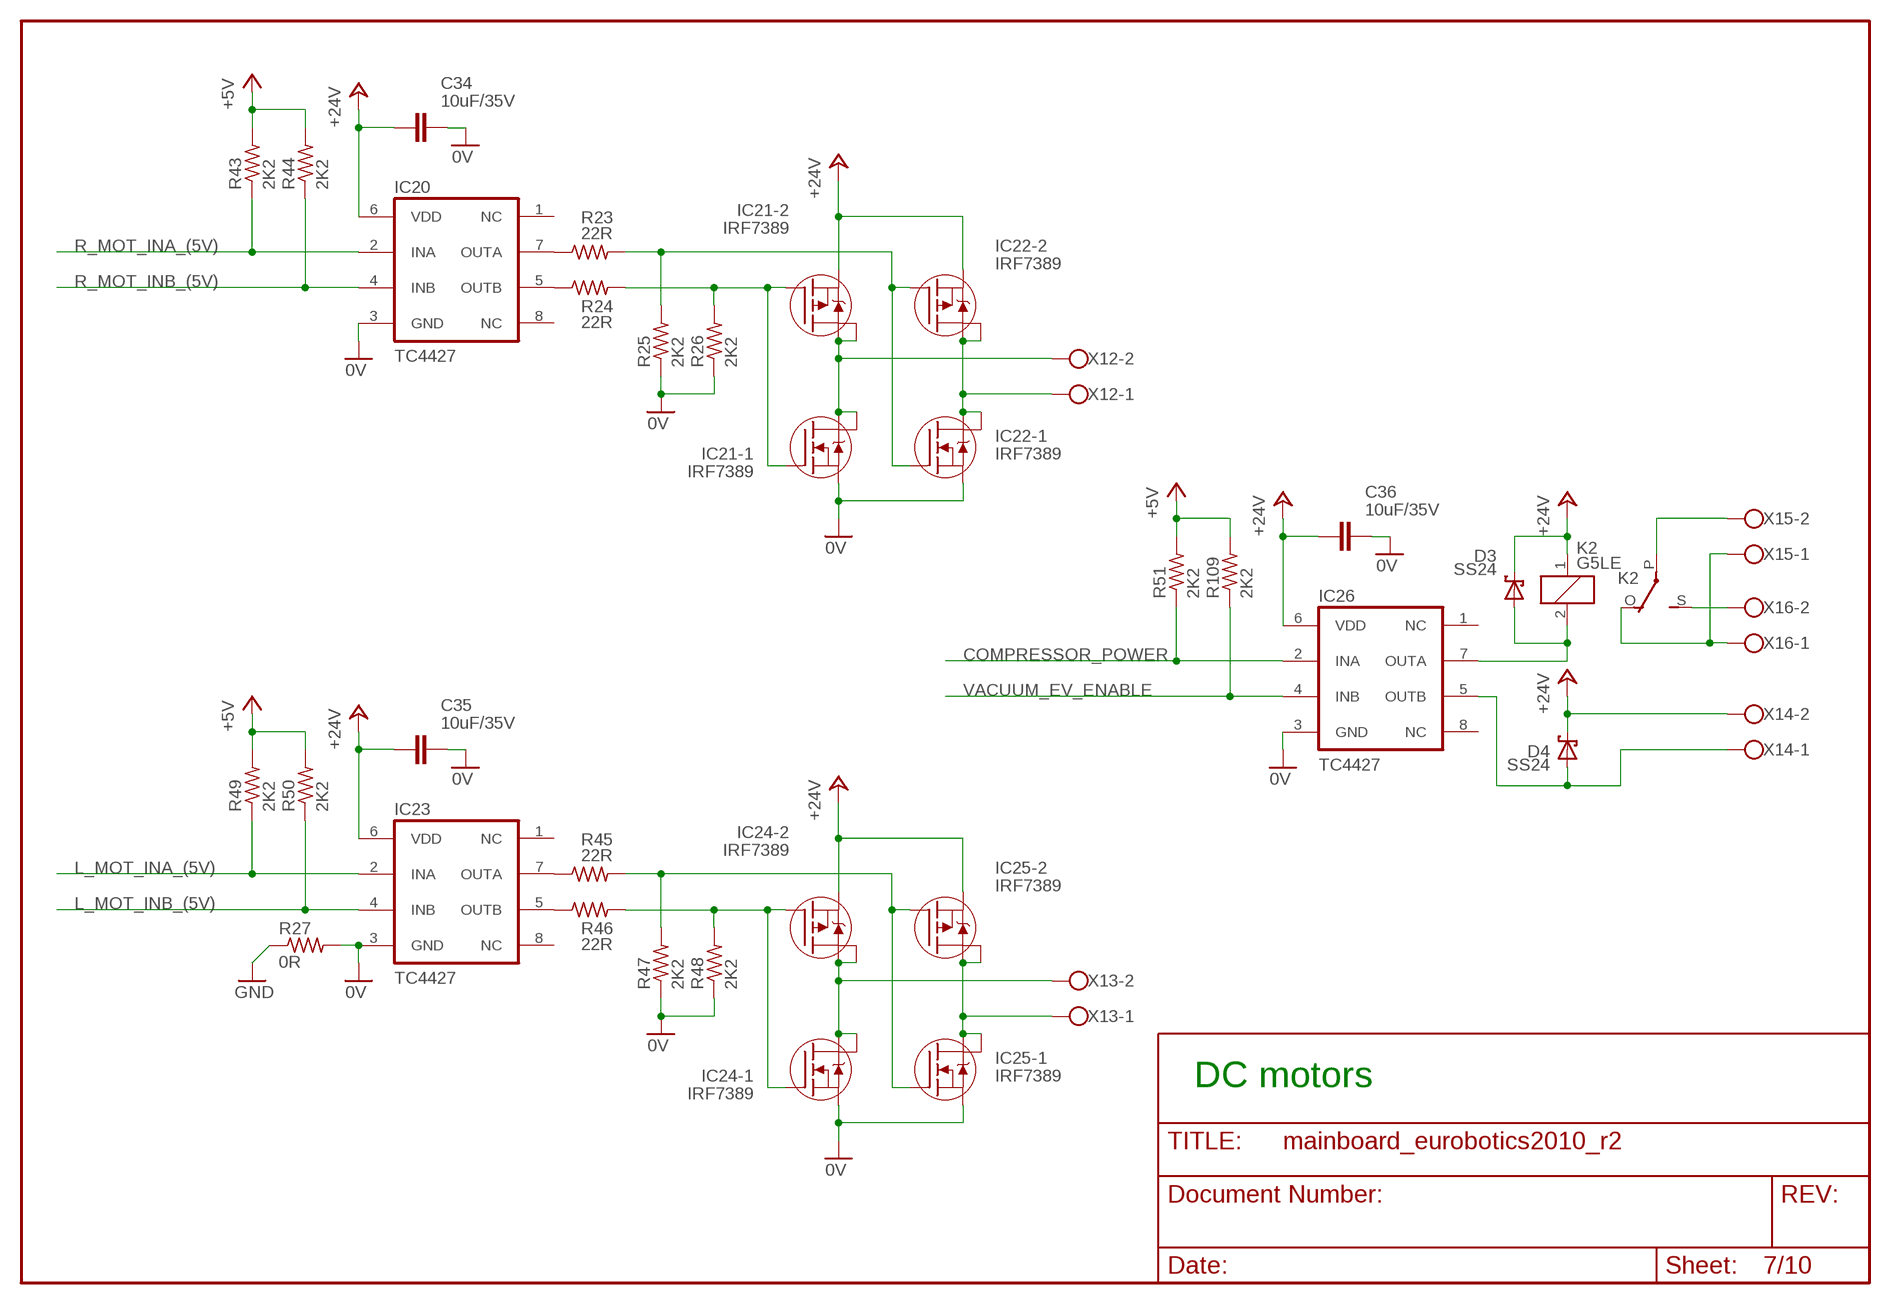
[diagram p6: schematic, sheet 7]

### Parts
C34  10uF/35V  C-EUC1206  [C1206]
C35  10uF/35V  C-EUC1206  [C1206]
C36  10uF/35V  C-EUC1206  [C1206]
D3  SS24  SCHOTTKY_SMB  [DIOM5436X265N]
D4  SS24  SCHOTTKY_SMB  [DIOM5436X265N]
IC20  TC4427  TC4427OA  [SO08]
IC21  IRF7389  [SO08]
IC22  IRF7389  [SO08]
IC23  TC4427  TC4427OA  [SO08]
IC24  IRF7389  [SO08]
IC25  IRF7389  [SO08]
IC26  TC4427  TC4427OA  [SO08]
K2  G5LE  [G5LE]
R23  22R  R-US_R0805  [R0805]
R24  22R  R-US_R0805  [R0805]
R25  2K2  R-US_R0805  [R0805]
R26  2K2  R-US_R0805  [R0805]
R27  0R  R-US_R0805  [R0805]
R43  2K2  R-US_R0805  [R0805]
R44  2K2  R-US_R0805  [R0805]
R45  22R  R-US_R0805  [R0805]
R46  22R  R-US_R0805  [R0805]
R47  2K2  R-US_R0805  [R0805]
R48  2K2  R-US_R0805  [R0805]
R49  2K2  R-US_R0805  [R0805]
R50  2K2  R-US_R0805  [R0805]
R51  2K2  R-US_R0805  [R0805]
R109  2K2  R-US_R0805  [R0805]
X12  W237-02P  [W237-132]
X13  W237-02P  [W237-132]
X14  W237-02P  [W237-132]
X15  W237-02P  [W237-132]
X16  W237-02P  [W237-132]

### Nets
0V: C34.1 C35.1 C36.1 IC20.3(GND) IC21.1(-1:S) IC22.1(-1:S) IC23.3(GND) IC24.1(-1:S) IC25.1(-1:S) IC26.3(GND) R25.1 R26.1 R27.2 R47.1 R48.1 ; also sheet 1,8
+5V: R43.2 R44.2 R49.2 R50.2 R51.2 R109.2 ; also sheet 1,2,5,6,8
+24V: C34.2 C35.2 C36.2 D3.K D4.K IC20.6(VDD) IC21.3(-2:S) IC22.3(-2:S) IC23.6(VDD) IC24.3(-2:S) IC25.3(-2:S) IC26.6(VDD) K2.1 X14.2 ; also sheet 1,8
COMPRESSOR_POWER: IC26.2(INA) R51.1 ; also sheet 3
GND: R27.1 ; also sheet 1,2,3,5,8,9
L_MOT_INA_(5V): IC23.2(INA) R49.1 ; also sheet 3
L_MOT_INB_(5V): IC23.4(INB) R50.1 ; also sheet 3
N$2: IC21.5(-2:D) IC21.6(-2:D) IC21.7(-1:D) IC21.8(-1:D) X12.2
N$4: IC22.5(-2:D) IC22.6(-2:D) IC22.7(-1:D) IC22.8(-1:D) X12.1
N$6: IC21.2(-1:G) IC21.4(-2:G) R24.2 R26.2
N$7: IC22.2(-1:G) IC22.4(-2:G) R23.2 R25.2
N$14: IC20.7(OUTA) R23.1
N$15: IC20.5(OUTB) R24.1
N$17: IC24.5(-2:D) IC24.6(-2:D) IC24.7(-1:D) IC24.8(-1:D) X13.2
N$18: IC25.5(-2:D) IC25.6(-2:D) IC25.7(-1:D) IC25.8(-1:D) X13.1
N$19: IC24.2(-1:G) IC24.4(-2:G) R46.2 R48.2
N$20: IC25.2(-1:G) IC25.4(-2:G) R45.2 R47.2
N$21: IC23.7(OUTA) R45.1
N$22: IC23.5(OUTB) R46.1
N$23: D3.A IC26.7(OUTA) K2.2
N$24: K2.O(2:O) X15.1 X16.1
N$26: K2.P(2:P) X15.2
N$35: K2.S(2:S) X16.2
N$38: D4.A IC26.5(OUTB) X14.1
R_MOT_INA_(5V): IC20.2(INA) R43.1 ; also sheet 3
R_MOT_INB_(5V): IC20.4(INB) R44.1 ; also sheet 3
VACUUM_EV_ENABLE: IC26.4(INB) R109.1 ; also sheet 3
Unconnected: IC20.1(NC) IC20.8(NC) IC23.1(NC) IC23.8(NC) IC26.1(NC) IC26.8(NC)

### Notes on the sheet
- DC motors

## Sheet 8 of 10
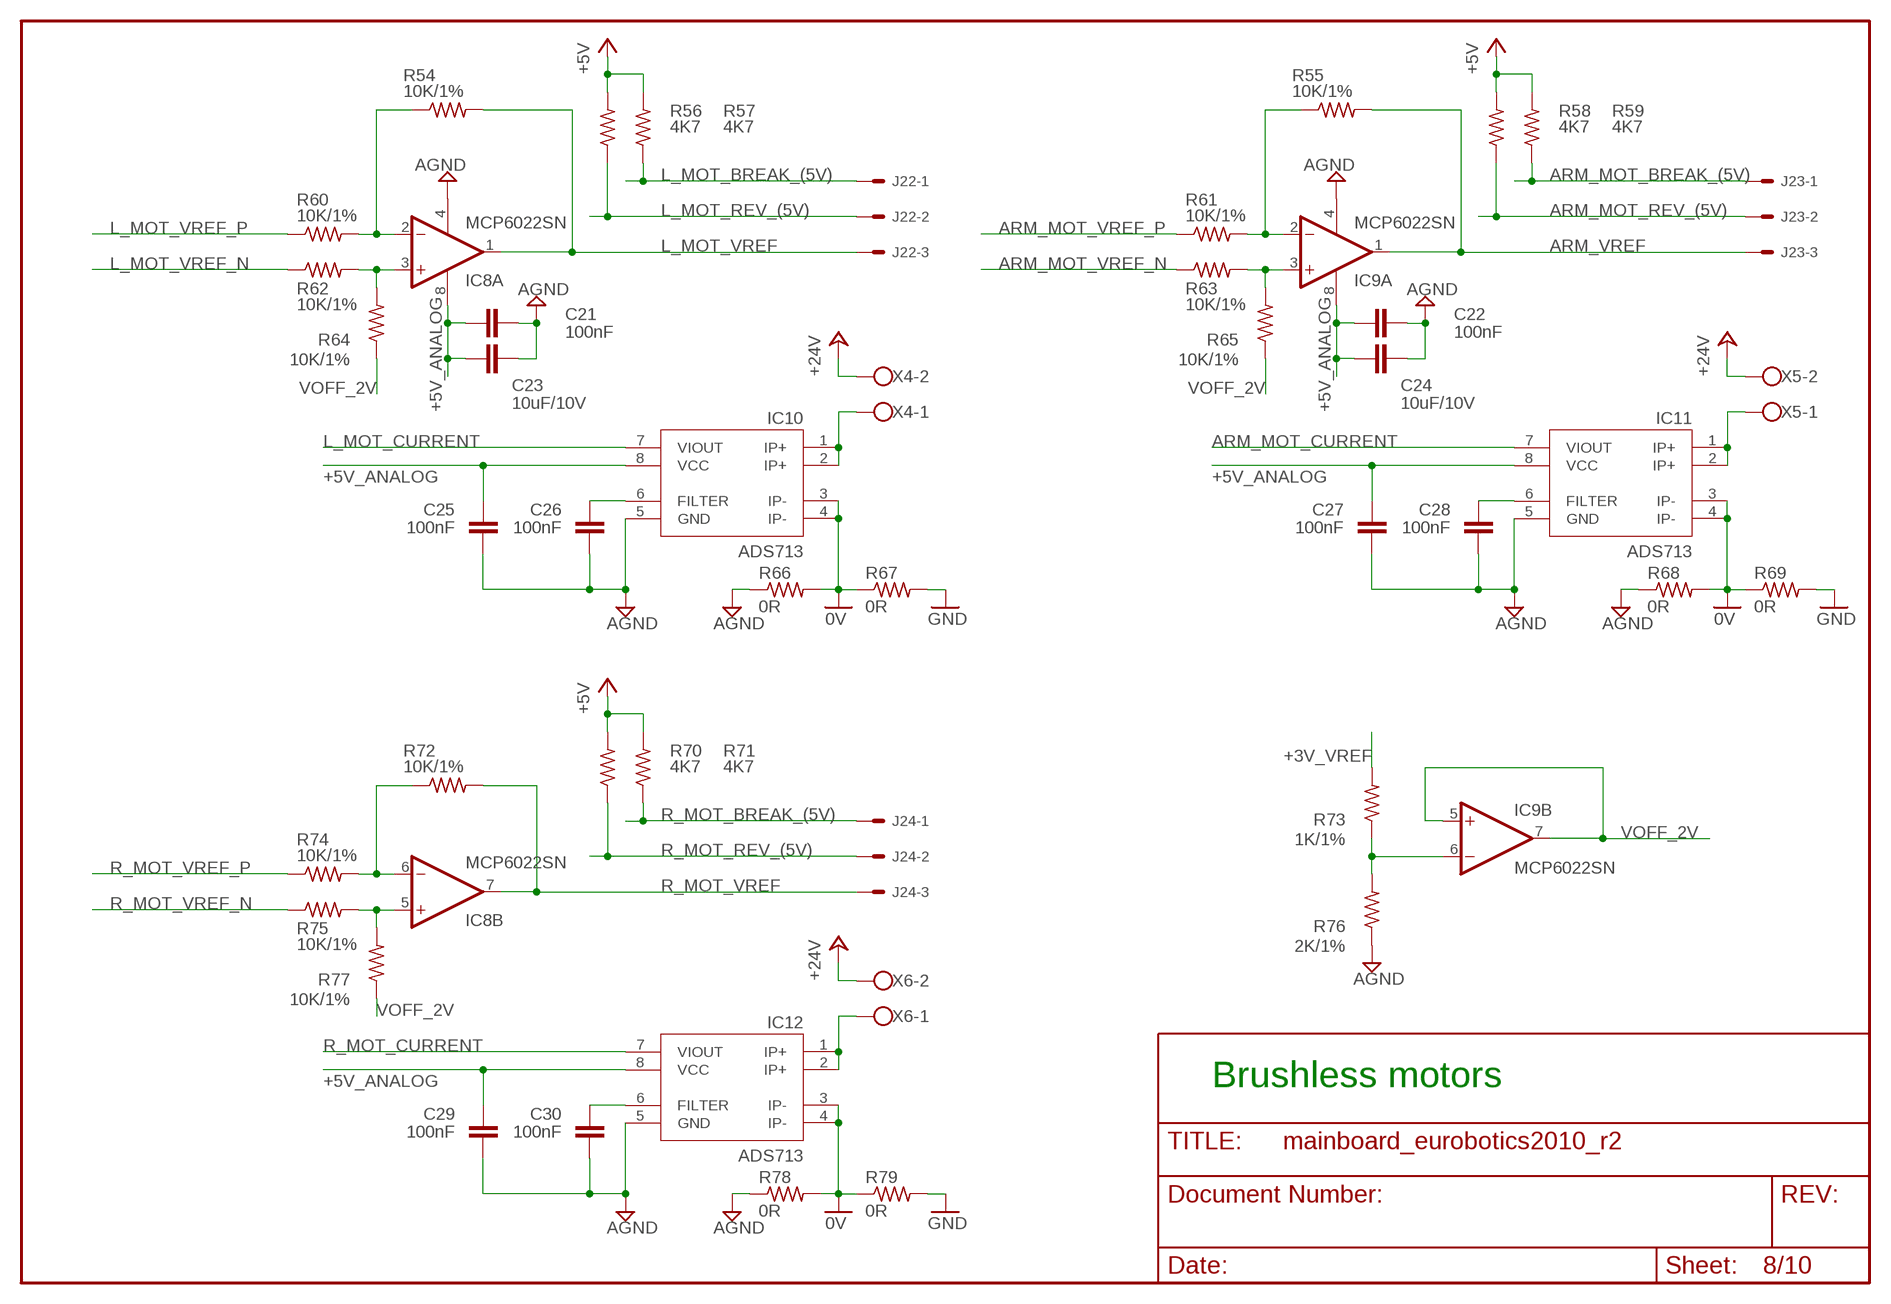
[diagram p7: schematic, sheet 8]

### Parts
C21  100nF  C-EUC0805  [C0805]
C22  100nF  C-EUC0805  [C0805]
C23  10uF/10V  C-EUC1206  [C1206]
C24  10uF/10V  C-EUC1206  [C1206]
C25  100nF  C-EUC0805  [C0805]
C26  100nF  C-EUC0805  [C0805]
C27  100nF  C-EUC0805  [C0805]
C28  100nF  C-EUC0805  [C0805]
C29  100nF  C-EUC0805  [C0805]
C30  100nF  C-EUC0805  [C0805]
IC8  MCP6022SN  OPA2344U  [SO08]
IC9  MCP6022SN  OPA2344U  [SO08]
IC10  ADS713  [SO08]
IC11  ADS713  [SO08]
IC12  ADS713  [SO08]
J22  22-27-2031-03  [6410-03]
J23  22-27-2031-03  [6410-03]
J24  22-27-2031-03  [6410-03]
R54  10K/1%  R-US_R0805  [R0805]
R55  10K/1%  R-US_R0805  [R0805]
R56  4K7  R-US_R0805  [R0805]
R57  4K7  R-US_R0805  [R0805]
R58  4K7  R-US_R0805  [R0805]
R59  4K7  R-US_R0805  [R0805]
R60  10K/1%  R-US_R0805  [R0805]
R61  10K/1%  R-US_R0805  [R0805]
R62  10K/1%  R-US_R0805  [R0805]
R63  10K/1%  R-US_R0805  [R0805]
R64  10K/1%  R-US_R0805  [R0805]
R65  10K/1%  R-US_R0805  [R0805]
R66  0R  R-US_R0805  [R0805]
R67  0R  R-US_R0805  [R0805]
R68  0R  R-US_R0805  [R0805]
R69  0R  R-US_R0805  [R0805]
R70  4K7  R-US_R0805  [R0805]
R71  4K7  R-US_R0805  [R0805]
R72  10K/1%  R-US_R0805  [R0805]
R73  1K/1%  R-US_R0805  [R0805]
R74  10K/1%  R-US_R0805  [R0805]
R75  10K/1%  R-US_R0805  [R0805]
R76  2K/1%  R-US_R0805  [R0805]
R77  10K/1%  R-US_R0805  [R0805]
R78  0R  R-US_R0805  [R0805]
R79  0R  R-US_R0805  [R0805]
X4  W237-02P  [W237-132]
X5  W237-02P  [W237-132]
X6  W237-02P  [W237-132]

### Nets
0V: IC10.3(IP-) IC10.4(IP-) IC11.3(IP-) IC11.4(IP-) IC12.3(IP-) IC12.4(IP-) R66.2 R67.1 R68.2 R69.1 R78.2 R79.1 ; also sheet 1,7
+3V_VREF: R73.2 ; also sheet 1,2,3,4
+5V: R56.2 R57.2 R58.2 R59.2 R70.2 R71.2 ; also sheet 1,2,5,6,7
+5V_ANALOG: C21.1 C22.1 C23.2 C24.2 C25.2 C27.2 C29.2 IC8.8(A:V+) IC9.8(A:V+) IC10.8(VCC) IC11.8(VCC) IC12.8(VCC) ; also sheet 1,4
+24V: X4.2 X5.2 X6.2 ; also sheet 1,7
AGND: C21.2 C22.2 C23.1 C24.1 C25.1 C26.1 C27.1 C28.1 C29.1 C30.1 IC8.4(A:V-) IC9.4(A:V-) IC10.5(GND) IC11.5(GND) IC12.5(GND) R66.1 R68.1 R76.1 R78.1 ; also sheet 1,2,3,4
ARM_MOT_BREAK_(5V): J23.1 R59.1 ; also sheet 3
ARM_MOT_CURRENT: IC11.7(VIOUT) ; also sheet 3
ARM_MOT_REV_(5V): J23.2 R58.1 ; also sheet 3
ARM_MOT_VREF_N: R63.1 ; also sheet 3
ARM_MOT_VREF_P: R61.1 ; also sheet 3
ARM_VREF: IC9.1(A:OUT) J23.3 R55.2
GND: R67.2 R69.2 R79.2 ; also sheet 1,2,3,5,7,9
L_MOT_BREAK_(5V): J22.1 R57.1 ; also sheet 2
L_MOT_CURRENT: IC10.7(VIOUT) ; also sheet 2
L_MOT_REV_(5V): J22.2 R56.1 ; also sheet 2
L_MOT_VREF: IC8.1(A:OUT) J22.3 R54.2
L_MOT_VREF_N: R62.1 ; also sheet 2
L_MOT_VREF_P: R60.1 ; also sheet 2
N$61: IC8.2(A:-IN) R54.1 R60.2
N$70: IC8.3(A:+IN) R62.2 R64.2
N$71: IC8.6(B:-IN) R72.1 R74.2
N$72: IC10.1(IP+) IC10.2(IP+) X4.1
N$73: C26.2 IC10.6(FILTER)
N$74: IC8.5(B:+IN) R75.2 R77.2
N$75: IC9.6(B:-IN) R73.1 R76.2
N$76: IC12.1(IP+) IC12.2(IP+) X6.1
N$77: C30.2 IC12.6(FILTER)
N$78: IC11.1(IP+) IC11.2(IP+) X5.1
N$79: C28.2 IC11.6(FILTER)
N$83: IC9.2(A:-IN) R55.1 R61.2
N$84: IC9.3(A:+IN) R63.2 R65.2
R_MOT_BREAK_(5V): J24.1 R71.1 ; also sheet 2
R_MOT_CURRENT: IC12.7(VIOUT) ; also sheet 2
R_MOT_REV_(5V): J24.2 R70.1 ; also sheet 2
R_MOT_VREF: IC8.7(B:OUT) J24.3 R72.2
R_MOT_VREF_N: R75.1 ; also sheet 2
R_MOT_VREF_P: R74.1 ; also sheet 2
VOFF_2V: IC9.5(B:+IN) IC9.7(B:OUT) R64.1 R65.1 R77.1

### Notes on the sheet
- Brushless motors

## Sheet 9 of 10
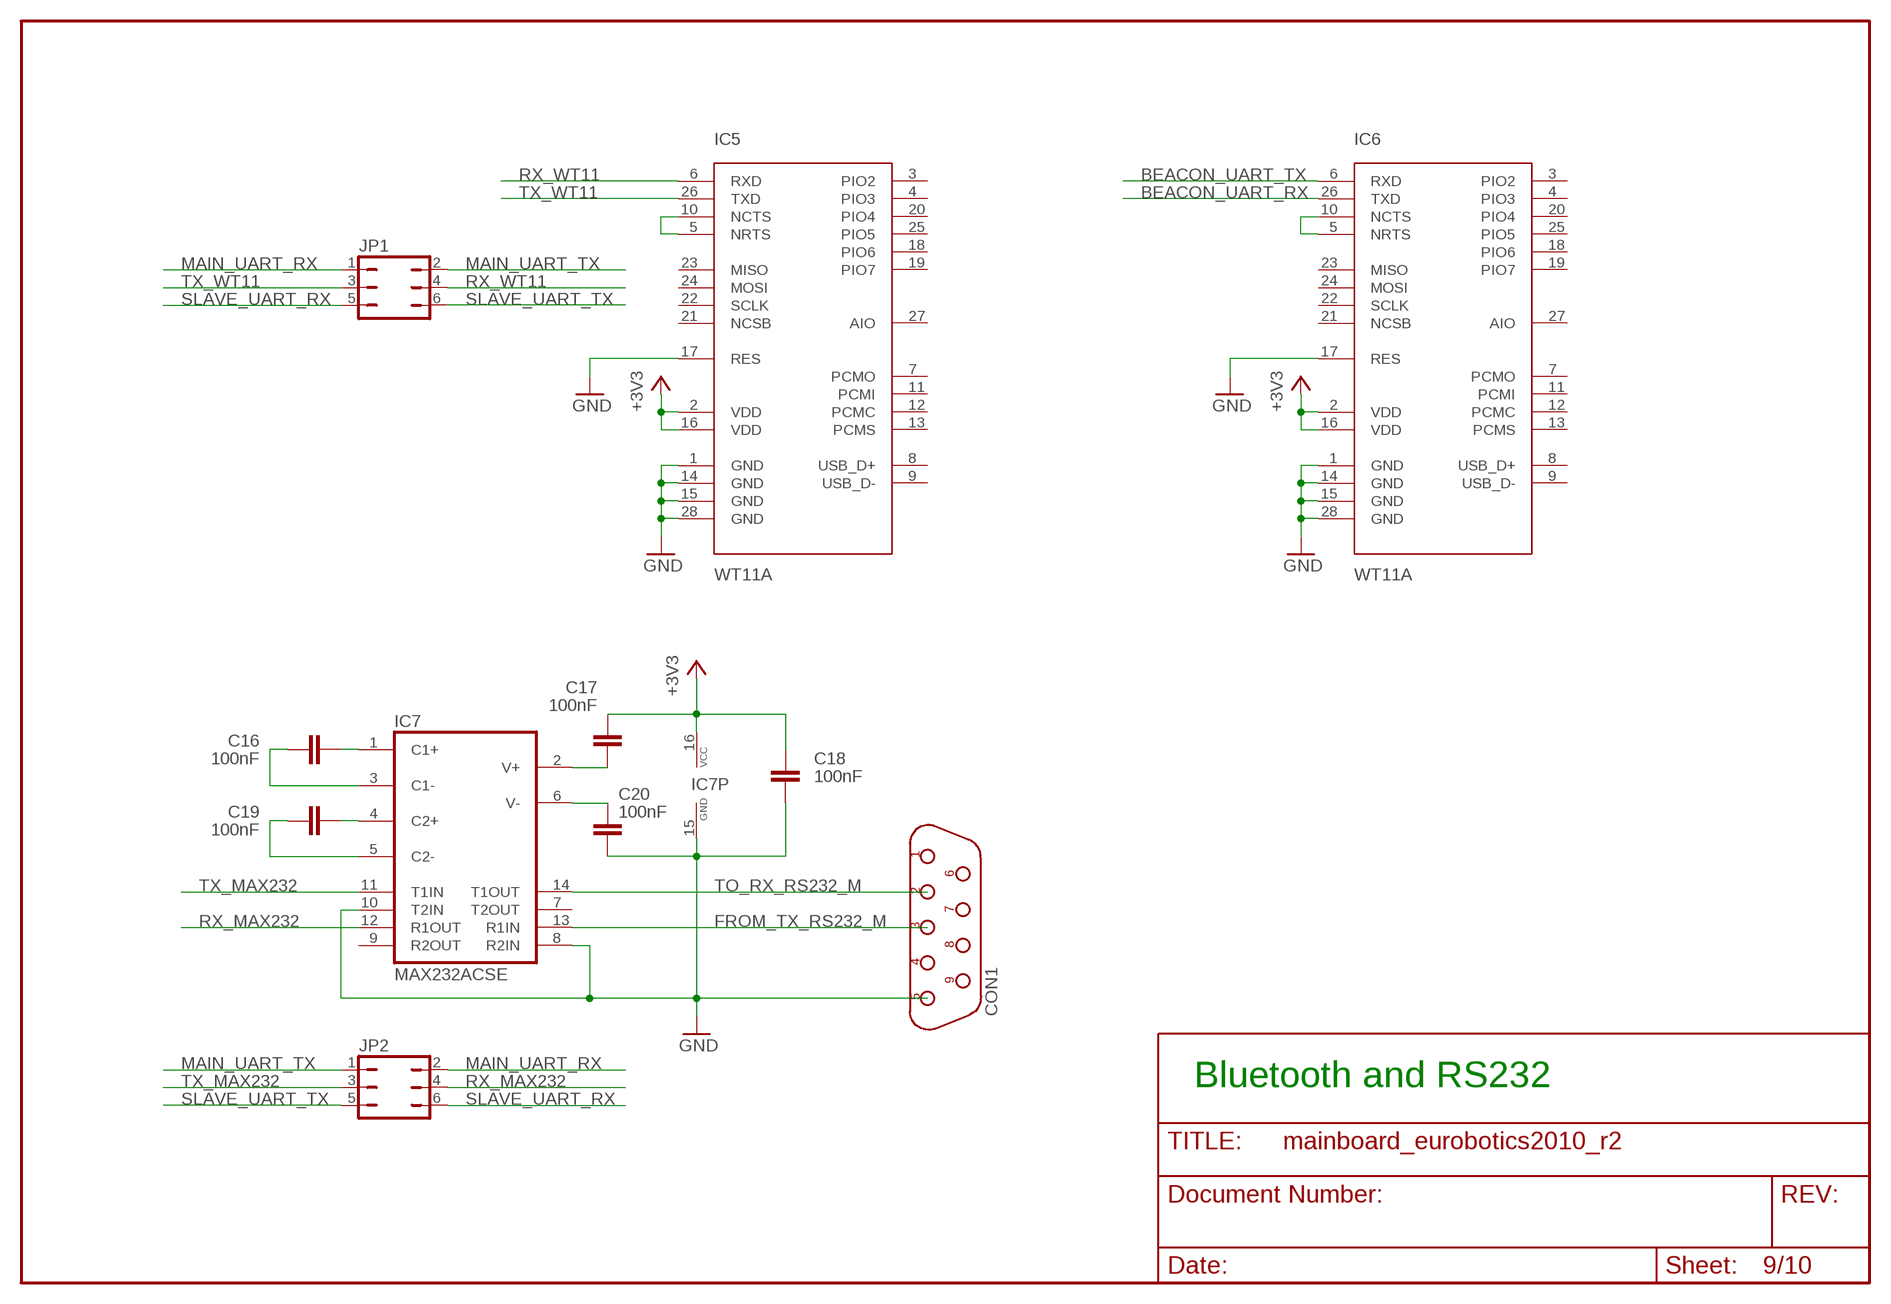
[diagram p8: schematic, sheet 9]

### Parts
C16  100nF  C-EUC0805  [C0805]
C17  100nF  C-EUC0805  [C0805]
C18  100nF  C-EUC0805  [C0805]
C19  100nF  C-EUC0805  [C0805]
C20  100nF  C-EUC0805  [C0805]
CON1  DB9F/90  [D-09F/90]
IC5  WT11A  [WT11]
IC6  WT11A  [WT11]
IC7  MAX232ACSE  [SO16]
JP1  JP3Q  [JP3Q]
JP2  JP3Q  [JP3Q]

### Nets
+3V3: C17.2 C18.2 IC5.2(VDD) IC5.16(VDD) IC6.2(VDD) IC6.16(VDD) IC7.16(VCC) ; also sheet 1,2,3
BEACON_UART_RX: IC6.26(TXD) ; also sheet 2
BEACON_UART_TX: IC6.6(RXD) ; also sheet 2
FROM_TX_RS232_M: CON1.3 IC7.13(R1IN)
GND: C18.1 C20.1 CON1.5 IC5.1(GND) IC5.14(GND) IC5.15(GND) IC5.17(RES) IC5.28(GND) IC6.1(GND) IC6.14(GND) IC6.15(GND) IC6.17(RES) IC6.28(GND) IC7.8(R2IN) IC7.10(T2IN) IC7.15(GND) ; also sheet 1,2,3,5,7,8
MAIN_UART_RX: JP1.1 JP2.2 ; also sheet 2
MAIN_UART_TX: JP1.2 JP2.1 ; also sheet 2
N$16: IC6.5(NRTS) IC6.10(NCTS)
N$27: C16.2 IC7.1(C1+)
N$30: C16.1 IC7.3(C1-)
N$31: C19.2 IC7.4(C2+)
N$32: C19.1 IC7.5(C2-)
N$33: C17.1 IC7.2(V+)
N$34: C20.2 IC7.6(V-)
N$93: IC5.5(NRTS) IC5.10(NCTS)
RX_MAX232: IC7.12(R1OUT) JP2.4
RX_WT11: IC5.6(RXD) JP1.4
SLAVE_UART_RX: JP1.5 JP2.6 ; also sheet 3
SLAVE_UART_TX: JP1.6 JP2.5 ; also sheet 3
TO_RX_RS232_M: CON1.2 IC7.14(T1OUT)
TX_MAX232: IC7.11(T1IN) JP2.3
TX_WT11: IC5.26(TXD) JP1.3
Unconnected: CON1.1 CON1.4 CON1.6 CON1.7 CON1.8 CON1.9 IC5.3(PIO2) IC5.4(PIO3) IC5.7(PCMO) IC5.8(USB_D+) IC5.9(USB_D-) IC5.11(PCMI) IC5.12(PCMC) IC5.13(PCMS) IC5.18(PIO6) IC5.19(PIO7) IC5.20(PIO4) IC5.21(NCSB) IC5.22(SCLK) IC5.23(MISO) IC5.24(MOSI) IC5.25(PIO5) IC5.27(AIO) IC6.3(PIO2) IC6.4(PIO3) IC6.7(PCMO) IC6.8(USB_D+) IC6.9(USB_D-) IC6.11(PCMI) IC6.12(PCMC) IC6.13(PCMS) IC6.18(PIO6) IC6.19(PIO7) IC6.20(PIO4) IC6.21(NCSB) IC6.22(SCLK) IC6.23(MISO) IC6.24(MOSI) IC6.25(PIO5) IC6.27(AIO) IC7.7(T2OUT) IC7.9(R2OUT)

### Notes on the sheet
- Bluetooth and RS232

## Sheet 10 of 10
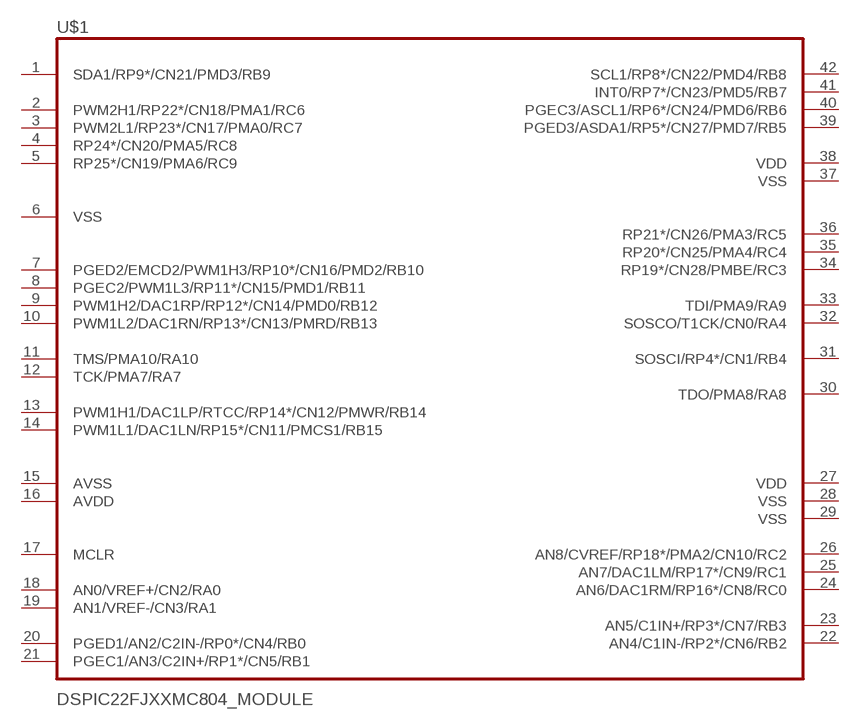
[diagram p9: schematic, sheet 10]

### Parts
U$1  DSPIC22FJXXMC804_MODULE  [DSPIC33FJXXMC804_MODULE]
Unconnected: U$1.1(SDA1/RP9*/CN21/PMD3/RB9) U$1.2(PWM2H1/RP22*/CN18/PMA1/RC6) U$1.3(PWM2L1/RP23*/CN17/PMA0/RC7) U$1.4(RP24*/CN20/PMA5/RC8) U$1.5(RP25*/CN19/PMA6/RC9) U$1.6(VSS) U$1.7(PGED2/EMCD2/PWM1H3/RP10*/CN16/PMD2/RB10) U$1.8(PGEC2/PWM1L3/RP11*/CN15/PMD1/RB11) U$1.9(PWM1H2/DAC1RP/RP12*/CN14/PMD0/RB12) U$1.10(PWM1L2/DAC1RN/RP13*/CN13/PMRD/RB13) U$1.11(TMS/PMA10/RA10) U$1.12(TCK/PMA7/RA7) U$1.13(PWM1H1/DAC1LP/RTCC/RP14*/CN12/PMWR/RB14) U$1.14(PWM1L1/DAC1LN/RP15*/CN11/PMCS1/RB15) U$1.15(AVSS) U$1.16(AVDD) U$1.17(MCLR) U$1.18(AN0/VREF+/CN2/RA0) U$1.19(AN1/VREF-/CN3/RA1) U$1.20(PGED1/AN2/C2IN-/RP0*/CN4/RB0) U$1.21(PGEC1/AN3/C2IN+/RP1*/CN5/RB1) U$1.22(AN4/C1IN-/RP2*/CN6/RB2) U$1.23(AN5/C1IN+/RP3*/CN7/RB3) U$1.24(AN6/DAC1RM/RP16*/CN8/RC0) U$1.25(AN7/DAC1LM/RP17*/CN9/RC1) U$1.26(AN8/CVREF/RP18*/PMA2/CN10/RC2) U$1.27(VDD) U$1.28(VSS) U$1.29(VSS) U$1.30(TDO/PMA8/RA8) U$1.31(SOSCI/RP4*/CN1/RB4) U$1.32(SOSCO/T1CK/CN0/RA4) U$1.33(TDI/PMA9/RA9) U$1.34(RP19*/CN28/PMBE/RC3) U$1.35(RP20*/CN25/PMA4/RC4) U$1.36(RP21*/CN26/PMA3/RC5) U$1.37(VSS) U$1.38(VDD) U$1.39(PGED3/ASDA1/RP5*/CN27/PMD7/RB5) U$1.40(PGEC3/ASCL1/RP6*/CN24/PMD6/RB6) U$1.41(INT0/RP7*/CN23/PMD5/RB7) U$1.42(SCL1/RP8*/CN22/PMD4/RB8)

## Library data of the parts
C1 C4-C7 C9 C11 C13-C30 C33-C36 C41-C43 C45-C49 C51 = rcl:C-EU: CAPACITOR, European symbol
C2 C3 C8 C10 C12 C44 C50 = rcl:CPOL-US: POLARIZED CAPACITOR, American symbol
CN1 = con-hdrs40:HDR-1X5: HEADER CONNECTOR
CON1 = connect:DB9F/90
CON3 = connect:DB9F
D3 D4 = ipc-7351-diode:SCHOTTKY_
F1 F2 = fuse:FUSE: Fuse
IC1 = v-reg:LM317?*: 500 mA Adjustable Output Positive Voltage Regulator Source: http://www.onsemi.co.jp .. LM317M-D.PDF
IC2 = eagle_jbs_lib:ADR443
IC3 = linear:*317: Positive VOLTAGE REGULATOR
IC4 IC8 IC9 = linear:OPA2*: Dual Operational Amplifier Low Power, Single-Supply, Rail-To-Rail Operational Amplifier Source: http://focus.ti.com/lit/ds/symlink/opa2345.pdf
IC5 IC6 = eagle_jbs_lib:WT11
IC7 = maxim-10:MAX232*: RS232 TRANSEIVER
IC10-IC12 = eagle_jbs_lib:ADS713
IC13 IC14 = eagle_jbs_lib:DSPIC33FJXXMC804
IC20 IC23 IC26 = eagle_jbs_lib:TC4427
IC21 IC22 IC24 IC25 = eagle_jbs_lib:IRF7389
J2 J19 = con-molex:22-?-02: CONNECTOR wire to board 2.54 mm (.1 inch) pitch header
J11-J16 J22-J24 J28-J34 = con-molex:22-?-03: CONNECTOR wire to board 2.54 mm (.1 inch) pitch header
J17 J18 = con-molex:22-?-05: CONNECTOR wire to board 2.54 mm (.1 inch) pitch header
J25-J27 = con-molex:22-?-04: CONNECTOR wire to board 2.54 mm (.1 inch) pitch header
JP1 JP2 = jumper:JP3Q: JUMPER
JP4 = jumper:JP2E: JUMPER
K2 = relay:G5LE: RELAY 1 x switch, 10 A/120 V AC, 8 A/30 V DC, Omron
LED1-LED5 LED10-LED14 = led:LED: LED OSRAM: - CHIPLED LG R971, LG N971, LY N971, LG Q971, LY Q971, LO R971, LY R971 LH N974, LH R974 LS Q976, LO Q976, LY Q976 LO Q996 - Hyper CHIPLED LW Q18S LB Q993, LB Q99A, LB R99A - SideLED LS A670, LO A670, LY A670, LG A670, LP A670 LB A673, LV A673, LT A673, LW A673 LH A674 LY A675 LS A676, LA A676, LO A676, LY A676, LW A676 LS A679, LY A679, LG A679 - Hyper Micro SIDELED® LS Y876, LA Y876, LO Y876, LY Y876 LT Y87S - SmartLED LW L88C, LW L88S LB L89C, LB L89S, LG L890 LS L89K, LO L89K, LY L89K LS L896, LA L896, LO L896, LY L896 - TOPLED LS T670, LO T670, LY T670, LG T670, LP T670 LSG T670, LSP T670, LSY T670, LOP T670, LYG T670 LG T671, LOG T671, LSG T671 LB T673, LV T673, LT T673, LW T673 LH T674 LS T676, LA T676, LO T676, LY T676, LB T676, LH T676, LSB T676, LW T676 LB T67C, LV T67C, LT T67C, LS T67K, LO T67K, LY T67K, LW E67C LS E67B, LA E67B, LO E67B, LY E67B, LB E67C, LV E67C, LT E67C LW T67C LS T679, LY T679, LG T679 LS T770, LO T770, LY T770, LG T770, LP T770 LB T773, LV T773, LT T773, LW T773 LH T774 LS E675, LA E675, LY E675, LS T675 LS T776, LA T776, LO T776, LY T776, LB T776 LHGB T686 LT T68C, LB T68C - Hyper Mini TOPLED® LB M676 - Mini TOPLED Santana® LG M470 LS M47K, LO M47K, LY M47K Source: http://www.osram.convergy.de/
Q2 Q3 = crystal:CRYSTAL: CRYSTAL
R1-R79 R95-R109 = rcl:R-US_: RESISTOR, American symbol
S2 = switch-omron:10-XX: OMRON SWITCH
U$1 = eagle_jbs_lib:DSPIC22FJXXMC804_MODULE
X1-X6 X12-X16 = con-wago-508:W237-02P: WAGO SREW CLAMP

## Board
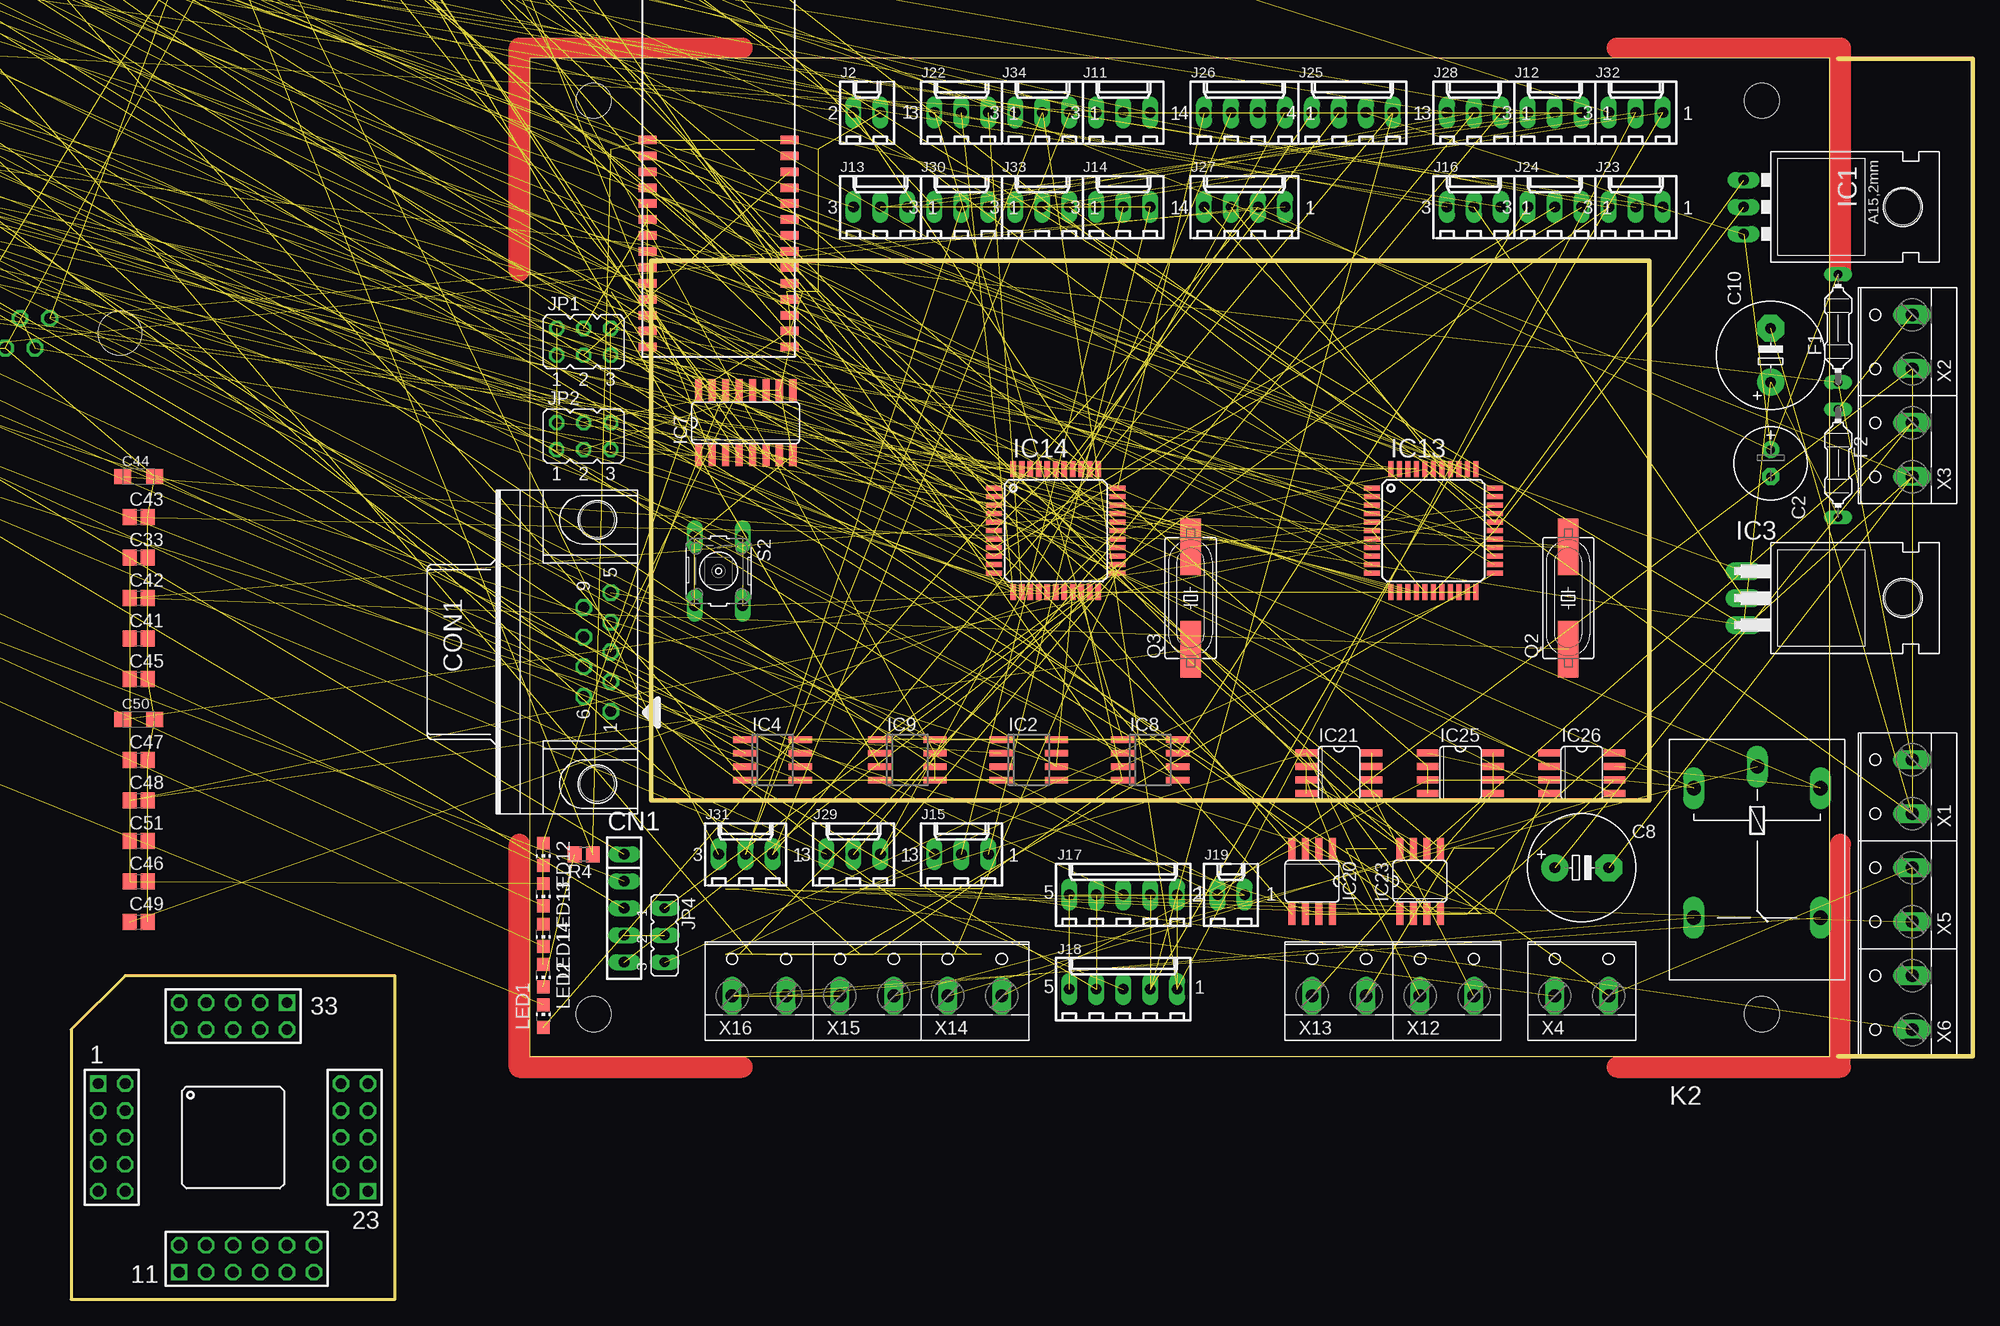
[diagram p10: board, top side]
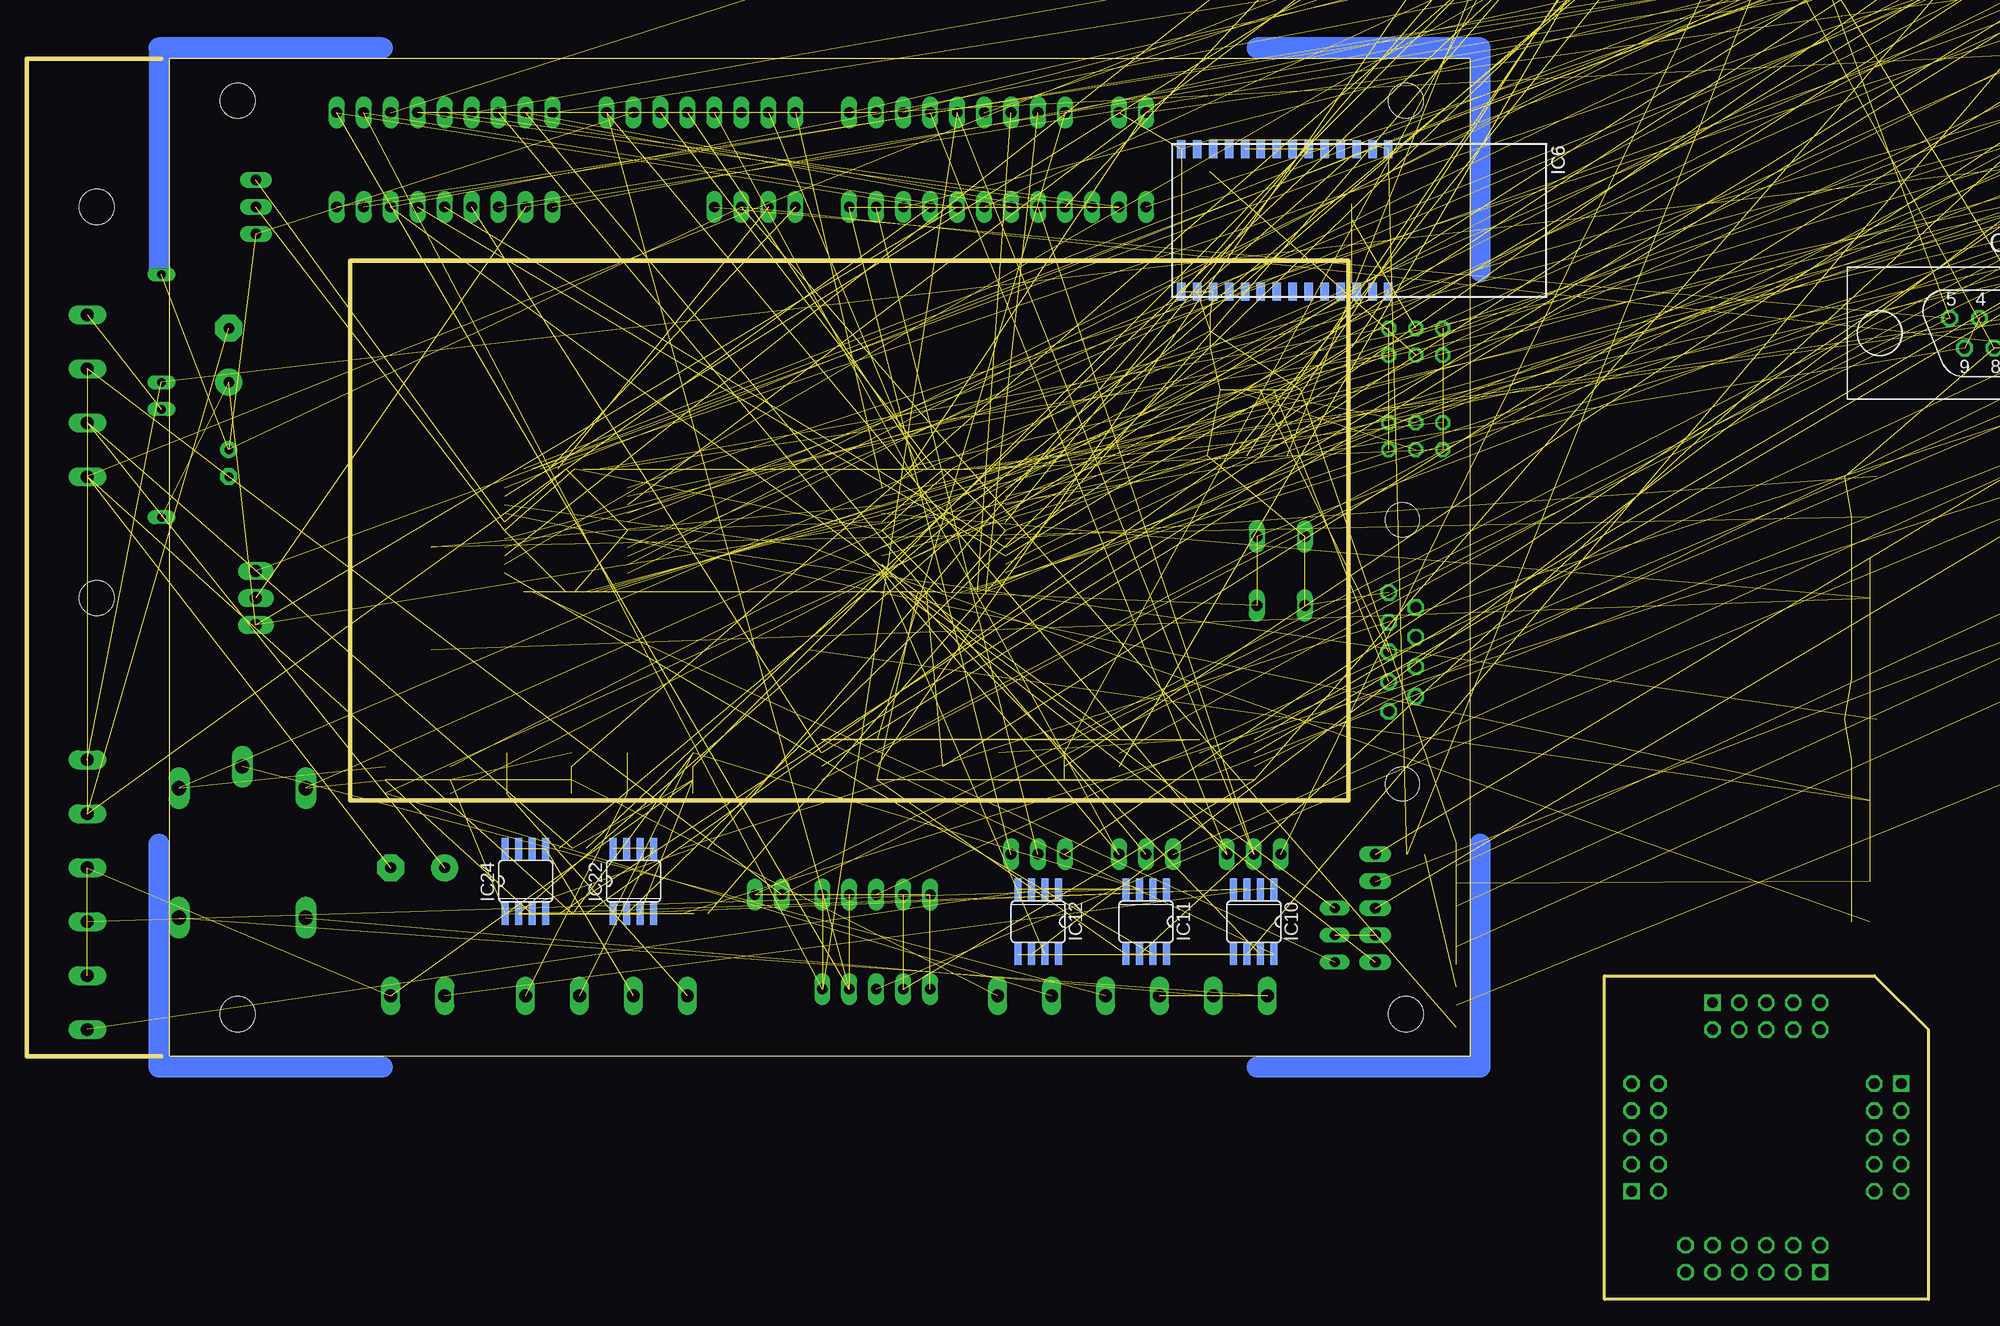
[diagram p11: board, bottom side, seen from below]

Size 179.07 x 116.86 mm. Coordinates in mm from the lower left corner, seen from the top.
Outline: 166.37,22.86 179.07,22.86 179.07,116.84 166.37,116.84
Outline: 43.18,22.86 165.58,22.86 165.58,116.86 43.18,116.86 43.18,22.86
Outline: 54.61,46.99 54.61,97.79 148.59,97.79 148.59,46.99 54.61,46.99
Copper layers (1*16): Top 0.035mm / dielectric 1.5mm / Bottom 0.035mm
Design rules "default": minimum track width 10mil, minimum drill 24mil, track to track 8mil, track to pad 8mil, pad to pad 8mil, via to via 8mil, smd to smd 8mil, copper to edge 40mil, drill to drill 8mil, minimum pad ring 10mil, minimum via ring 8mil, stop-mask expansion 4mil, vias tented up to drill 0mil, thermal gap 10mil
Holes 3.3 mm at 49.18,26.86 159.18,26.86 49.18,112.86 159.18,112.86

### Footprints (pad centres in the part's own frame; a part is rotated, then mirrored left to right if it is on the bottom)
C0805 = smd 1.3 x 1.5: 1 -0.85,0; 2 0.85,0
E2,5-7 = drill 0.813 pad 1.6 round: + -1.27,0 | drill 0.813 pad 1.6 octagon: - 1.27,0
SMC_D = smd 2.4 x 2.8: + -3.15,0; - 3.15,0
C1206 = smd 1.6 x 1.8: 1 -1.4,0; 2 1.4,0
E5-10,5 = drill 1.016 pad 2.54 round: + -2.54,0 | drill 1.016 pad 2.54 octagon: - 2.54,0
SMC_A = smd 1.6 x 1.4: + -1.5,0; - 1.5,0
SIP-100-5V = drill 1.016 long: 1 -5.08,0; 2 -2.54,0; 3 0,0; 4 2.54,0; 5 5.08,0
D-09F/90 = drill 1.016 pad 1.575 octagon: 1 -5.588,-1.27; 2 -2.794,-1.27; 3 0,-1.27; 4 2.794,-1.27; 5 5.588,-1.27; 6 -4.191,1.27; 7 -1.397,1.27; 8 1.397,1.27; 9 4.191,1.27 | hole 3.2: 12.446,0; -12.446,0
D-09F = drill 1.016 pad 1.575 octagon: 1 5.588,1.397; 2 2.794,1.397; 3 0,1.397; 4 -2.794,1.397; 5 -5.588,1.397; 6 4.191,-1.397; 7 1.397,-1.397; 8 -1.397,-1.397; 9 -4.191,-1.397 | hole 4.115: 12.192,0; -12.192,0
DIOM5436X265N = smd 2.2 x 2.05: A 2.2,0; K -2.2,0
PICOFUSE = drill 0.813 long: 1 -5.08,0; 2 5.08,0
TO220L1 = drill 1.016 long: 1 -2.54,-3.81; 2 0,-3.81; 3 2.54,-3.81 | hole 3.302: 0,11.176
SOIC8 = smd 0.6 x 2.2: 1 -1.905,-2.6; 2 -0.635,-2.6; 3 0.635,-2.6; 4 1.905,-2.6; 5 1.905,2.6; 6 0.635,2.6; 7 -0.635,2.6; 8 -1.905,2.6
TO220H = drill 1.118 long: 1 -2.54,-10.16; 2 0,-10.16; 3 2.54,-10.16 | hole 3.302: 0,4.826
SO08 = smd 0.6 x 2.2: 1 -1.905,-2.6; 2 -0.635,-2.6; 3 0.635,-2.6; 4 1.905,-2.6; 5 1.905,2.6; 6 0.635,2.6; 7 -0.635,2.6; 8 -1.905,2.6
WT11 = smd 1.7 x 0.8: 1 -6.7,2.5; 2 -6.7,1; 3 -6.7,-0.5; 4 -6.7,-2; 5 -6.7,-3.5; 6 -6.7,-5; 7 -6.7,-6.5; 8 -6.7,-8; 9 -6.7,-9.5; 10 -6.7,-11; 11 -6.7,-12.5; 12 -6.7,-14; 13 -6.7,-15.5; 14 -6.7,-17; 15 6.7,-17; 16 6.7,-15.5; 17 6.7,-14; 18 6.7,-12.5; 19 6.7,-11; 20 6.7,-9.5; 21 6.7,-8; 22 6.7,-6.5; 23 6.7,-5; 24 6.7,-3.5; 25 6.7,-2; 26 6.7,-0.5; 27 6.7,1; 28 6.7,2.5
SO16 = smd 0.66 x 2.032: 1 -4.445,-3.073; 2 -3.175,-3.073; 3 -1.905,-3.073; 4 -0.635,-3.073; 5 0.635,-3.073; 6 1.905,-3.073; 7 3.175,-3.073; 8 4.445,-3.073; 9 4.445,3.073; 10 3.175,3.073; 11 1.905,3.073; 12 0.635,3.073; 13 -0.635,3.073; 14 -1.905,3.073; 15 -3.175,3.073; 16 -4.445,3.073
SO08' = smd 0.66 x 2.032: 1 -1.905,-3.073; 2 -0.635,-3.073; 3 0.635,-3.073; 4 1.905,-3.073; 5 1.905,3.073; 6 0.635,3.073; 7 -0.635,3.073; 8 -1.905,3.073
TQFP44 = smd 1.5 x 0.5: 1 -5.8,4; 2 -5.8,3.2; 3 -5.8,2.4; 4 -5.8,1.6; 5 -5.8,0.8; 6 -5.8,0; 7 -5.8,-0.8; 8 -5.8,-1.6; 9 -5.8,-2.4; 10 -5.8,-3.2; 11 -5.8,-4; 23 5.8,-4; 24 5.8,-3.2; 25 5.8,-2.4; 26 5.8,-1.6; 27 5.8,-0.8; 28 5.8,0; 29 5.8,0.8; 30 5.8,1.6; 31 5.8,2.4; 32 5.8,3.2; 33 5.8,4 | smd 0.5 x 1.5: 12 -4,-5.8; 13 -3.2,-5.8; 14 -2.4,-5.8; 15 -1.6,-5.8; 16 -0.8,-5.8; 17 0,-5.8; 18 0.8,-5.8; 19 1.6,-5.8; 20 2.4,-5.8; 21 3.2,-5.8; 22 4,-5.8; 34 4,5.8; 35 3.2,5.8; 36 2.4,5.8; 37 1.6,5.8; 38 0.8,5.8; 39 0,5.8; 40 -0.8,5.8; 41 -1.6,5.8; 42 -2.4,5.8; 43 -3.2,5.8; 44 -4,5.8
6410-02 = drill 1.016 long: 1 1.27,0; 2 -1.27,0
6410-03 = drill 1.016 long: 1 2.54,0; 2 0,0; 3 -2.54,0
6410-05 = drill 1.016 long: 1 5.08,0; 2 2.54,0; 3 0,0; 4 -2.54,0; 5 -5.08,0
6410-04 = drill 1.016 long: 1 3.81,0; 2 1.27,0; 3 -1.27,0; 4 -3.81,0
JP3Q = drill 0.914 octagon: 1 -2.54,-1.27; 2 -2.54,1.27; 3 0,-1.27; 4 0,1.27; 5 2.54,-1.27; 6 2.54,1.27
JP2 = drill 0.914 long: 1 -2.54,0; 2 0,0; 3 2.54,0
G5LE = drill 1.321 long: 1 -7.493,-5.969; 2 -7.493,5.969; O 4.699,5.969; P -9.525,0; S 4.699,-5.969
CHIP-LED0805 = smd 1.2 x 1.2: A 0,-1.05; C 0,1.05
HC49UP = smd 5.334 x 1.93: 1 -4.826,0; 2 4.826,0
R0805 = smd 1.3 x 1.5: 1 -0.85,0; 2 0.85,0
B3F-10XX = drill 1.016 long: 1 -3.251,2.261; 2 3.251,2.261; 3 -3.251,-2.261; 4 3.251,-2.261
DSPIC33FJXXMC804_MODULE = drill 1.016 square: 1 2.54,20.32; 11 10.16,2.54; 23 27.94,10.16; 33 20.32,27.94 | drill 1.016 octagon: 2 5.08,20.32; 3 2.54,17.78; 4 5.08,17.78; 5 2.54,15.24; 6 5.08,15.24; 7 2.54,12.7; 8 5.08,12.7; 9 2.54,10.16; 10 5.08,10.16; 12 10.16,5.08; 13 12.7,2.54; 14 12.7,5.08; 15 15.24,2.54; 16 15.24,5.08; 17 17.78,2.54; 18 17.78,5.08; 19 20.32,2.54; 20 20.32,5.08; 21 22.86,2.54; 22 22.86,5.08; 24 25.4,10.16; 25 27.94,12.7; 26 25.4,12.7; 27 27.94,15.24; 28 25.4,15.24; 29 27.94,17.78; 30 25.4,17.78; 31 27.94,20.32; 32 25.4,20.32; 34 20.32,25.4; 35 17.78,27.94; 36 17.78,25.4; 37 15.24,27.94; 38 15.24,25.4; 39 12.7,27.94; 40 12.7,25.4; 41 10.16,27.94; 42 10.16,25.4
W237-132 = drill 1.194 long: 1 -2.54,-0.635; 2 2.54,-0.635

### Placement (x,y rotation side)
C1  -101.6,165.1 0 top  (outside the outline)
C2  160.02,78.74 270 top
C3  10.16,125.73 0 top  (outside the outline)
C4  -113.03,165.1 0 top  (outside the outline)
C5  -59.69,125.73 0 top  (outside the outline)
C6  -124.46,165.1 0 top  (outside the outline)
C7  -135.89,165.1 0 top  (outside the outline)
C8  142.24,40.64 0 top
C9  -147.32,165.1 0 top  (outside the outline)
C10  160.02,88.9 90 top
C11  -158.75,165.1 0 top  (outside the outline)
C12  -5.08,125.73 0 top  (outside the outline)
C13  -170.18,165.1 0 top  (outside the outline)
C14  -181.61,165.1 0 top  (outside the outline)
C15  -71.12,125.73 0 top  (outside the outline)
C16  -193.04,165.1 0 top  (outside the outline)
C17  24.13,172.72 0 top  (outside the outline)
C18  12.7,172.72 0 top  (outside the outline)
C19  1.27,172.72 0 top  (outside the outline)
C20  -10.16,172.72 0 top  (outside the outline)
C21  -21.59,172.72 0 top  (outside the outline)
C22  -33.02,172.72 0 top  (outside the outline)
C23  -82.55,125.73 0 top  (outside the outline)
C24  -93.98,125.73 0 top  (outside the outline)
C25  -44.45,172.72 0 top  (outside the outline)
C26  -55.88,172.72 0 top  (outside the outline)
C27  -67.31,172.72 0 top  (outside the outline)
C28  -78.74,172.72 0 top  (outside the outline)
C29  -90.17,172.72 0 top  (outside the outline)
C30  -101.6,172.72 0 top  (outside the outline)
C33  6.35,69.85 0 top
C34  -105.41,125.73 0 top  (outside the outline)
C35  -116.84,125.73 0 top  (outside the outline)
C36  -128.27,125.73 0 top  (outside the outline)
C41  6.35,62.23 0 top
C42  6.35,66.04 0 top
C43  6.35,73.66 0 top
C44  6.35,77.47 0 top
C45  6.35,58.42 0 top
C46  6.35,39.37 0 top
C47  6.35,50.8 0 top
C48  6.35,46.99 0 top
C49  6.35,35.56 0 top
C50  6.35,54.61 0 top
C51  6.35,43.18 0 top
CN1  52.07,36.83 270 top
CON1  49.53,60.96 90 top
CON3  -7.61,90.98 0 bottom
D3  -19.05,125.73 0 top  (outside the outline)
D4  -31.75,125.73 0 top  (outside the outline)
F1  166.37,91.44 90 top
F2  166.37,78.74 270 top
IC1  161.29,102.87 270 top
IC2  90.17,50.8 270 top
IC3  167.64,66.04 270 top
IC4  66.04,50.8 270 top
IC5  60.96,106.68 0 top
IC6  53.34,101.6 270 bottom
IC7  63.5,82.55 0 top
IC8  101.6,50.8 270 top
IC9  78.74,50.8 270 top
IC10  ADS713  [SO08']  63.5,35.56 180 bottom
IC11  ADS713  [SO08']  73.66,35.56 180 bottom
IC12  ADS713  [SO08']  83.82,35.56 180 bottom
IC13  128.27,72.39 0 top
IC14  92.71,72.39 0 top
IC20  TC4427  [SO08']  116.84,39.37 180 top
IC21  IRF7389  [SO08']  119.38,49.53 270 top
IC22  IRF7389  [SO08']  121.92,39.37 0 bottom
IC23  TC4427  [SO08']  127,39.37 0 top
IC24  IRF7389  [SO08']  132.08,39.37 0 bottom
IC25  IRF7389  [SO08']  130.81,49.53 270 top
IC26  TC4427  [SO08']  142.24,49.53 270 top
J2  74.93,111.76 0 top
J11  99.06,111.76 0 top
J12  139.7,111.76 0 top
J13  76.2,102.87 0 top
J14  99.06,102.87 0 top
J15  83.82,41.91 0 top
J16  132.08,102.87 0 top
J17  99.06,38.1 0 top
J18  99.06,29.21 0 top
J19  109.22,38.1 0 top
J22  83.82,111.76 0 top
J23  147.32,102.87 0 top
J24  139.7,102.87 0 top
J25  120.65,111.76 0 top
J26  110.49,111.76 0 top
J27  110.49,102.87 0 top
J28  132.08,111.76 0 top
J29  73.66,41.91 0 top
J30  83.82,102.87 0 top
J31  63.5,41.91 0 top
J32  147.32,111.76 0 top
J33  91.44,102.87 0 top
J34  91.44,111.76 0 top
JP1  48.26,90.17 0 top
JP2  48.26,81.28 0 top
JP4  55.88,34.29 270 top
K2  158.75,40.64 270 top
LED1  44.45,26.67 0 top
LED2  44.45,30.48 180 top
LED3  -115.57,114.3 0 top  (outside the outline)
LED4  -121.92,114.3 0 top  (outside the outline)
LED5  -128.27,114.3 0 top  (outside the outline)
LED10  -134.62,114.3 0 top  (outside the outline)
LED11  -140.97,114.3 0 top  (outside the outline)
LED12  44.45,41.91 180 top
LED13  44.45,38.1 180 top
LED14  44.45,34.29 180 top
Q2  140.97,66.04 90 top
Q3  105.41,66.04 90 top
R1  -175.26,125.73 0 top  (outside the outline)
R2  -186.69,125.73 0 top  (outside the outline)
R3  -198.12,125.73 0 top  (outside the outline)
R4  48.26,41.91 180 top
R5  12.7,134.62 0 top  (outside the outline)
R6  1.27,134.62 0 top  (outside the outline)
R7  -10.16,134.62 0 top  (outside the outline)
R8  -21.59,134.62 0 top  (outside the outline)
R9  -33.02,134.62 0 top  (outside the outline)
R10  -44.45,134.62 0 top  (outside the outline)
R11  -55.88,134.62 0 top  (outside the outline)
R12  -67.31,134.62 0 top  (outside the outline)
R13  -78.74,134.62 0 top  (outside the outline)
R14  -90.17,134.62 0 top  (outside the outline)
R15  -101.6,134.62 0 top  (outside the outline)
R16  -113.03,134.62 0 top  (outside the outline)
R17  -124.46,134.62 0 top  (outside the outline)
R18  -135.89,134.62 0 top  (outside the outline)
R19  -147.32,134.62 0 top  (outside the outline)
R20  -158.75,134.62 0 top  (outside the outline)
R21  -170.18,134.62 0 top  (outside the outline)
R22  -181.61,134.62 0 top  (outside the outline)
R23  -193.04,134.62 0 top  (outside the outline)
R24  24.13,142.24 0 top  (outside the outline)
R25  12.7,142.24 0 top  (outside the outline)
R26  1.27,142.24 0 top  (outside the outline)
R27  -10.16,142.24 0 top  (outside the outline)
R28  -21.59,142.24 0 top  (outside the outline)
R29  -33.02,142.24 0 top  (outside the outline)
R30  -44.45,142.24 0 top  (outside the outline)
R31  -55.88,142.24 0 top  (outside the outline)
R32  -67.31,142.24 0 top  (outside the outline)
R33  -78.74,142.24 0 top  (outside the outline)
R34  -90.17,142.24 0 top  (outside the outline)
R35  -101.6,142.24 0 top  (outside the outline)
R36  -113.03,142.24 0 top  (outside the outline)
R37  -124.46,142.24 0 top  (outside the outline)
R38  -135.89,142.24 0 top  (outside the outline)
R39  -147.32,142.24 0 top  (outside the outline)
R40  -158.75,142.24 0 top  (outside the outline)
R41  -170.18,142.24 0 top  (outside the outline)
R42  -181.61,142.24 0 top  (outside the outline)
R43  -193.04,142.24 0 top  (outside the outline)
R44  24.13,149.86 0 top  (outside the outline)
R45  12.7,149.86 0 top  (outside the outline)
R46  1.27,149.86 0 top  (outside the outline)
R47  -10.16,149.86 0 top  (outside the outline)
R48  -21.59,149.86 0 top  (outside the outline)
R49  -33.02,149.86 0 top  (outside the outline)
R50  -44.45,149.86 0 top  (outside the outline)
R51  -55.88,149.86 0 top  (outside the outline)
R52  -67.31,149.86 0 top  (outside the outline)
R53  -78.74,149.86 0 top  (outside the outline)
R54  -90.17,149.86 0 top  (outside the outline)
R55  -101.6,149.86 0 top  (outside the outline)
R56  -113.03,149.86 0 top  (outside the outline)
R57  -124.46,149.86 0 top  (outside the outline)
R58  -135.89,149.86 0 top  (outside the outline)
R59  -147.32,149.86 0 top  (outside the outline)
R60  -158.75,149.86 0 top  (outside the outline)
R61  -170.18,149.86 0 top  (outside the outline)
R62  -181.61,149.86 0 top  (outside the outline)
R63  -193.04,149.86 0 top  (outside the outline)
R64  24.13,157.48 0 top  (outside the outline)
R65  12.7,157.48 0 top  (outside the outline)
R66  1.27,157.48 0 top  (outside the outline)
R67  -10.16,157.48 0 top  (outside the outline)
R68  -21.59,157.48 0 top  (outside the outline)
R69  -33.02,157.48 0 top  (outside the outline)
R70  -44.45,157.48 0 top  (outside the outline)
R71  -55.88,157.48 0 top  (outside the outline)
R72  -67.31,157.48 0 top  (outside the outline)
R73  -78.74,157.48 0 top  (outside the outline)
R74  -90.17,157.48 0 top  (outside the outline)
R75  -101.6,157.48 0 top  (outside the outline)
R76  -113.03,157.48 0 top  (outside the outline)
R77  -124.46,157.48 0 top  (outside the outline)
R78  -135.89,157.48 0 top  (outside the outline)
R79  -147.32,157.48 0 top  (outside the outline)
R95  -158.75,157.48 0 top  (outside the outline)
R96  -170.18,157.48 0 top  (outside the outline)
R97  -181.61,157.48 0 top  (outside the outline)
R98  -193.04,157.48 0 top  (outside the outline)
R99  24.13,165.1 0 top  (outside the outline)
R100  12.7,165.1 0 top  (outside the outline)
R101  1.27,165.1 0 top  (outside the outline)
R102  -10.16,165.1 0 top  (outside the outline)
R103  -21.59,165.1 0 top  (outside the outline)
R104  -33.02,165.1 0 top  (outside the outline)
R105  -44.45,165.1 0 top  (outside the outline)
R106  -55.88,165.1 0 top  (outside the outline)
R107  -67.31,165.1 0 top  (outside the outline)
R108  -78.74,165.1 0 top  (outside the outline)
R109  -90.17,165.1 0 top  (outside the outline)
S2  60.96,68.58 270 top
U$1  0,0 0 top
X1  172.72,48.26 90 top
X2  172.72,90.17 90 top
X3  172.72,80.01 90 top
X4  142.24,29.21 0 top
X5  172.72,38.1 90 top
X6  172.72,27.94 90 top
X12  129.54,29.21 0 top
X13  119.38,29.21 0 top
X14  85.09,29.21 0 top
X15  74.93,29.21 0 top
X16  64.77,29.21 0 top

### Tracks (layer width: path | path; a pad name or v marks a point on that pad's centre or on a via)
0V  (30 unrouted)
+3V3  (30 unrouted)
+3V_VREF  (6 unrouted)
+5V  (36 unrouted)
+5V_ANALOG  (18 unrouted)
+12V  (16 unrouted)
+24V  (20 unrouted)
AGND  (34 unrouted)
ARM_ENC_CHA  (1 unrouted)
ARM_ENC_CHB  (1 unrouted)
ARM_MOT_BREAK_(5V)  (2 unrouted)
ARM_MOT_CURRENT  (1 unrouted)
ARM_MOT_REV_(5V)  (2 unrouted)
ARM_MOT_VREF_N  (1 unrouted)
ARM_MOT_VREF_P  (1 unrouted)
ARM_VREF  (2 unrouted)
BEACON_UART_RX  (1 unrouted)
BEACON_UART_TX  (1 unrouted)
COMPRESSOR_POWER  (2 unrouted)
CORN_INSIDE_SENSOR  (3 unrouted)
CORN_PUSH_PWM_(5V)  (2 unrouted)
FROM_TX_RS232_M  (1 unrouted)
G_RST  (5 unrouted)
GND  (53 unrouted)
GND_SERVO_5V  (5 unrouted)
GND_SERVO_9.6V  (5 unrouted)
GNDIO  (32 unrouted)
I2C_SCL_(5V)  (3 unrouted)
I2C_SDA_(5V)  (3 unrouted)
L_BALL_IN_SENSOR  (3 unrouted)
L_BALLS_LID_PWM_(5V)  (2 unrouted)
L_CORN_HOLD_PWM_(5V)  (2 unrouted)
L_ENC_CHA  (1 unrouted)
L_ENC_CHB  (1 unrouted)
L_MOT_BREAK_(5V)  (2 unrouted)
L_MOT_CURRENT  (1 unrouted)
L_MOT_INA_(5V)  (2 unrouted)
L_MOT_INB_(5V)  (2 unrouted)
L_MOT_REV_(5V)  (2 unrouted)
L_MOT_VREF  (2 unrouted)
L_MOT_VREF_N  (1 unrouted)
L_MOT_VREF_P  (1 unrouted)
LASER_BALL_SCAN  (2 unrouted)
LASER_CORN_SCAN  (2 unrouted)
MAIN_AUX1  (3 unrouted)
MAIN_AUX2  (3 unrouted)
MAIN_LED1  (1 unrouted)
MAIN_LED2  (1 unrouted)
MAIN_LED3  (1 unrouted)
MAIN_LED4  (1 unrouted)
MAIN_PGED  (1 unrouted)
MAIN_UART_RX  (2 unrouted)
MAIN_UART_TX  (2 unrouted)
N$1  (1 unrouted)
N$2  (4 unrouted)
N$3  (2 unrouted)
N$4  (4 unrouted)
N$5  (1 unrouted)
N$6  (3 unrouted)
N$7  (3 unrouted)
N$8  (1 unrouted)
N$10  (1 unrouted)
N$11  (1 unrouted)
N$12  (1 unrouted)
N$13  (1 unrouted)
N$14  (1 unrouted)
N$15  (1 unrouted)
N$16  (1 unrouted)
N$17  (4 unrouted)
N$18  (4 unrouted)
N$19  (3 unrouted)
N$20  (3 unrouted)
N$21  (1 unrouted)
N$22  (1 unrouted)
N$23  (2 unrouted)
N$24  (2 unrouted)
N$25
  Top 2: 63.18,21.86 42.18,21.86 42.18,42.86
N$26  (1 unrouted)
N$27  (1 unrouted)
N$28
  Top 2: 145.58,21.86 166.58,21.86 166.58,42.86
N$29
  Top 2: 63.18,117.86 42.18,117.86 42.18,96.86
N$30  (1 unrouted)
N$31  (1 unrouted)
N$32  (1 unrouted)
N$33  (1 unrouted)
N$34  (1 unrouted)
N$35  (1 unrouted)
N$36  (2 unrouted)
N$37
  Top 2: 166.58,96.86 166.58,117.86 145.58,117.86
N$38  (2 unrouted)
N$39
  Bottom 2: 63.18,21.86 42.18,21.86 42.18,42.86
N$40  (2 unrouted)
N$41
  Bottom 2: 145.58,21.86 166.58,21.86 166.58,42.86
N$42
  Bottom 2: 63.18,117.86 42.18,117.86 42.18,96.86
N$43
  Bottom 2: 166.58,96.86 166.58,117.86 145.58,117.86
N$47  (2 unrouted)
N$48  (2 unrouted)
N$49  (1 unrouted)
N$50  (2 unrouted)
N$51  (2 unrouted)
N$52  (1 unrouted)
N$61  (2 unrouted)
N$64  (1 unrouted)
N$65  (1 unrouted)
N$66  (1 unrouted)
N$67  (1 unrouted)
N$70  (2 unrouted)
N$71  (2 unrouted)
N$72  (2 unrouted)
N$73  (1 unrouted)
N$74  (2 unrouted)
N$75  (2 unrouted)
N$76  (2 unrouted)
N$77  (1 unrouted)
N$78  (2 unrouted)
N$79  (1 unrouted)
N$83  (2 unrouted)
N$84  (2 unrouted)
N$92  (3 unrouted)
N$93  (1 unrouted)
N$94  (2 unrouted)
N$95  (2 unrouted)
N$96  (1 unrouted)
N$112  (2 unrouted)
N$113  (1 unrouted)
PGEC  (2 unrouted)
PGED  (1 unrouted)
R_BALL_IN_SENSOR  (3 unrouted)
R_BALLS_LID_PWM_(5V)  (2 unrouted)
R_CORN_HOLD_PWM_(5V)  (2 unrouted)
R_ENC_CHA  (1 unrouted)
R_ENC_CHB  (1 unrouted)
R_MOT_BREAK_(5V)  (2 unrouted)
R_MOT_CURRENT  (1 unrouted)
R_MOT_INA_(5V)  (2 unrouted)
R_MOT_INB_(5V)  (2 unrouted)
R_MOT_REV_(5V)  (2 unrouted)
R_MOT_VREF  (2 unrouted)
R_MOT_VREF_N  (1 unrouted)
R_MOT_VREF_P  (1 unrouted)
RX_MAX232  (1 unrouted)
RX_WT11  (1 unrouted)
SERVOS_UART_(5V)  (2 unrouted)
SLAVE_LED1  (1 unrouted)
SLAVE_PGED  (1 unrouted)
SLAVE_UART_RX  (2 unrouted)
SLAVE_UART_TX  (2 unrouted)
START_(5V)  (2 unrouted)
SUCKER_OBJ_SENSOR  (3 unrouted)
TO_RX_RS232_M  (1 unrouted)
TX_MAX232  (1 unrouted)
TX_WT11  (1 unrouted)
VACUUM_EV_ENABLE  (2 unrouted)
VACUUM_SENSOR  (3 unrouted)
VCC_SERVO_5V  (5 unrouted)
VCC_SERVO_9.6V  (5 unrouted)
VOFF_2V  (4 unrouted)